# Altium project CM4-Tower.PrjPcb (part 1 of 4)
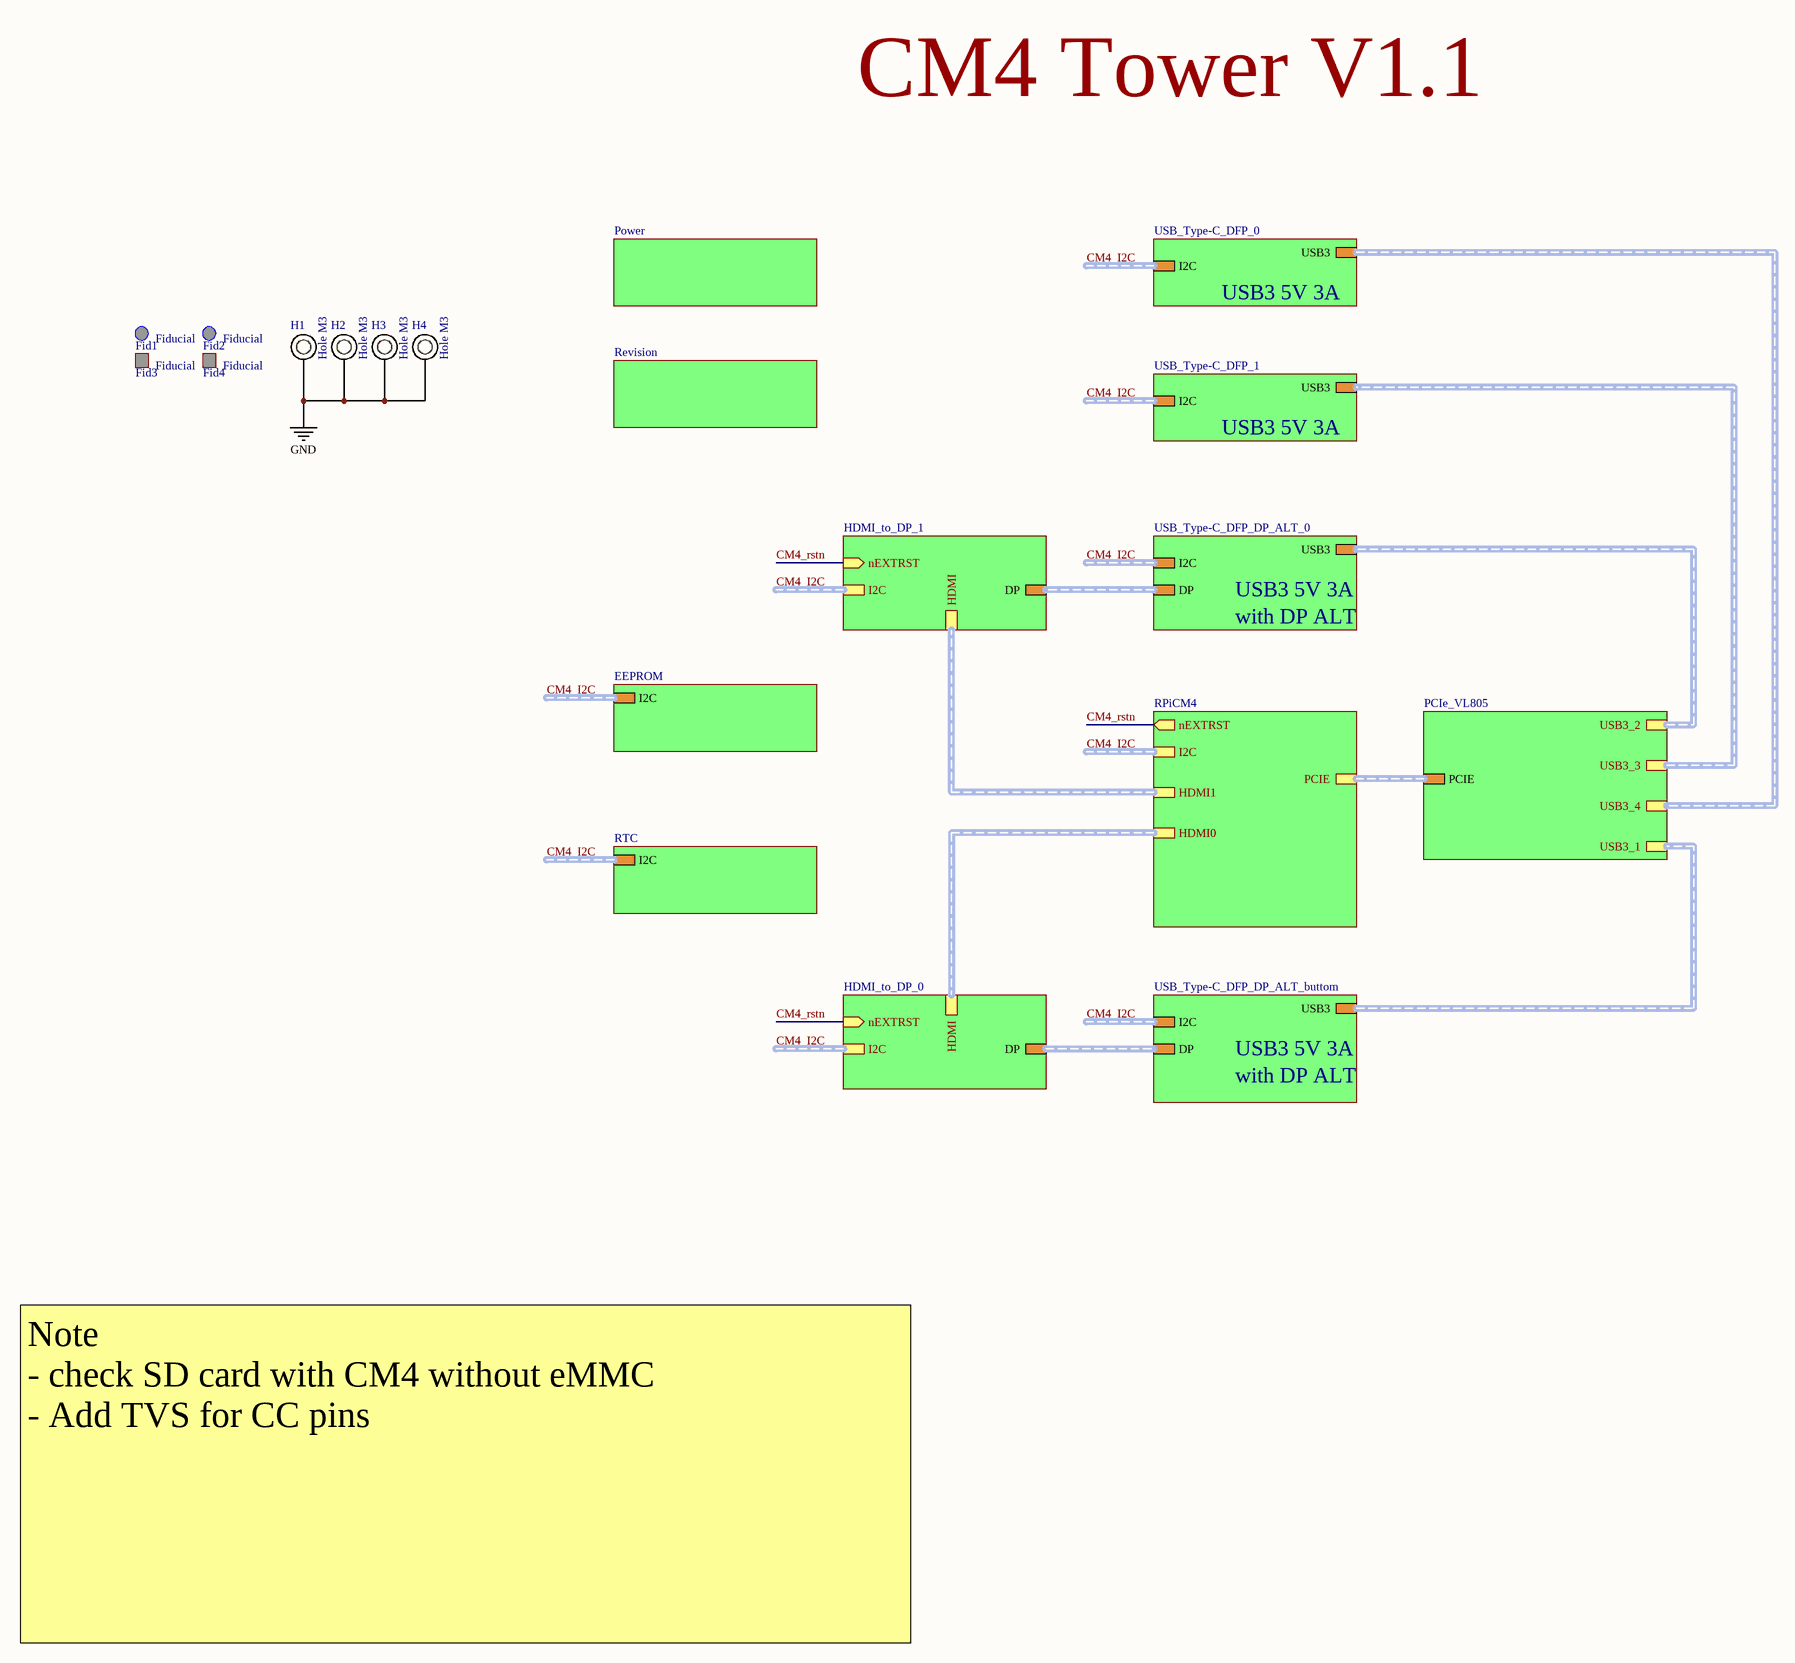
[diagram p0: 01_Top.SchDoc]
=Creator: Mahdi Changani; Rev: 1.1
11 sheets, 636 parts. Net scope: hierarchical (ports join the sheet entries above them; power ports are global).
Board file: CM4-Tower.PcbDoc
Sheets:
  01_Top.SchDoc
    USB_Type-C_DFP_DP_ALT_buttom = 08_USB_Type-C_DFP_DP_ALT_buttom.SchDoc
    Power = 02_Power.SchDoc
    RPiCM4 = 03_RPiCM4.SchDoc
    USB_Type-C_DFP_0 = 06_USB_Type-C_DFP.SchDoc
    USB_Type-C_DFP_1 = 06_USB_Type-C_DFP.SchDoc
    PCIe_VL805 = 04_PCIe_VL805.SchDoc
    HDMI_to_DP_0 = 05_HDMI_to_DP.SchDoc
    USB_Type-C_DFP_DP_ALT_0 = 07_USB_Type-C_DFP_DP_ALT.SchDoc
    HDMI_to_DP_1 = 05_HDMI_to_DP.SchDoc
    EEPROM = 10_EEPROM.SchDoc
    RTC = 09_RTC.SchDoc
    Revision = 11_Revision.SchDoc

## Sheet 01_Top.SchDoc: CM4 Tower part 2 Overview
size A2; Organization: Greenfield Tech Solutions; Address1: Molendreef 33; Address2: Ossendrecht; Address3: 4641CS; Address4: The Netherlands; Revision: 1.1; SheetNumber: 1; SheetTotal: 11

### Parts
Fid1  Fiducial  [FidR_1.0mm]  (no BOM)
Fid2  Fiducial  [FidR_1.0mm]  (no BOM)
Fid3  Fiducial  [FidS_1.0mm]  (no BOM)
Fid4  Fiducial  [FidS_1.0mm]  (no BOM)
H1  Hole M3  [HOLE_M3]  (no BOM)
H2  Hole M3  [HOLE_M3]  (no BOM)
H3  Hole M3  [HOLE_M3]  (no BOM)
H4  Hole M3  [HOLE_M3]  (no BOM)

### Sub-sheets
EEPROM = 10_EEPROM.SchDoc: I2C (harness I2C)
HDMI_to_DP_0 = 05_HDMI_to_DP.SchDoc: DP (harness DP), HDMI (harness HDMI), nEXTRST (in), I2C (harness I2C)
HDMI_to_DP_1 = 05_HDMI_to_DP.SchDoc: DP (harness DP), HDMI (harness HDMI), nEXTRST (in), I2C (harness I2C)
PCIe_VL805 = 04_PCIe_VL805.SchDoc: PCIE (harness PCIE), USB3_1 (harness USB3), USB3_2 (harness USB3), USB3_3 (harness USB3), USB3_4 (harness USB3)
Power = 02_Power.SchDoc: no entries
Revision = 11_Revision.SchDoc: no entries
RPiCM4 = 03_RPiCM4.SchDoc: I2C (harness I2C), PCIE (harness PCIE), HDMI0 (harness HDMI), HDMI1 (harness HDMI), nEXTRST (out)
RTC = 09_RTC.SchDoc: I2C (harness I2C)
USB_Type-C_DFP_0 = 06_USB_Type-C_DFP.SchDoc: USB3 (harness USB3), I2C (harness I2C)
USB_Type-C_DFP_1 = 06_USB_Type-C_DFP.SchDoc: USB3 (harness USB3), I2C (harness I2C)
USB_Type-C_DFP_DP_ALT_0 = 07_USB_Type-C_DFP_DP_ALT.SchDoc: USB3 (harness USB3), I2C (harness I2C), DP (harness DP)
USB_Type-C_DFP_DP_ALT_buttom = 08_USB_Type-C_DFP_DP_ALT_buttom.SchDoc: USB3 (harness USB3), I2C (harness I2C), DP (harness DP)

### Nets
GND: H1.1 H2.1 H3.1 H4.1
CM4_rstn: sheet RPiCM4/nEXTRST, sheet HDMI_to_DP_0/nEXTRST, sheet HDMI_to_DP_1/nEXTRST

### Buses and harness runs
harness CM4_I2C = sheet EEPROM/I2C
harness CM4_I2C = sheet HDMI_to_DP_0/I2C
harness CM4_I2C = sheet HDMI_to_DP_1/I2C
harness CM4_I2C = sheet RPiCM4/I2C
harness CM4_I2C = sheet RTC/I2C
harness CM4_I2C = sheet USB_Type-C_DFP_0/I2C
harness CM4_I2C = sheet USB_Type-C_DFP_1/I2C
harness CM4_I2C = sheet USB_Type-C_DFP_DP_ALT_0/I2C
harness CM4_I2C = sheet USB_Type-C_DFP_DP_ALT_buttom/I2C
harness sheet HDMI_to_DP_0/DP = sheet USB_Type-C_DFP_DP_ALT_buttom/DP
harness sheet HDMI_to_DP_0/HDMI = sheet RPiCM4/HDMI0
harness sheet HDMI_to_DP_1/DP = sheet USB_Type-C_DFP_DP_ALT_0/DP
harness sheet HDMI_to_DP_1/HDMI = sheet RPiCM4/HDMI1
harness sheet PCIe_VL805/PCIE = sheet RPiCM4/PCIE
harness sheet PCIe_VL805/USB3_1 = sheet USB_Type-C_DFP_DP_ALT_buttom/USB3
harness sheet PCIe_VL805/USB3_2 = sheet USB_Type-C_DFP_DP_ALT_0/USB3
harness sheet PCIe_VL805/USB3_3 = sheet USB_Type-C_DFP_1/USB3
harness sheet PCIe_VL805/USB3_4 = sheet USB_Type-C_DFP_0/USB3

### Notes on the sheet
- CM4 Tower V1.1
- USB3 5V 3A
- with DP ALT
- Note
  - check SD card with CM4 without eMMC
  - Add TVS for CC pins
- Title
- Size:
- Date:
- File:
- A2
- Number:
- Time:
- Revision:
- Sheet
- of

### Library data of the parts
Fid1 Fid2 = ME0011: Fiducial Round 1mm; Part Number: ME0011; ID: 11; RefVal: Fiducial
Fid3 Fid4 = ME0012: Fiducial Sqaure 1mm; Part Number: ME0012; ID: 12; RefVal: Fiducial
H1-H4 = ME0001: Mounting Hole M3; Part Number: ME0001; ID: 1; RefVal: Hole M3

## Sheet 08_USB_Type-C_DFP_DP_ALT_buttom.SchDoc: USB-C Connectors
size A2; Organization: Greenfield Tech Solutions; Address1: Molendreef 33; Address2: Ossendrecht; Address3: 4641CS; Address4: The Netherlands; Revision: 1.1; SheetNumber: 8; SheetTotal: 11
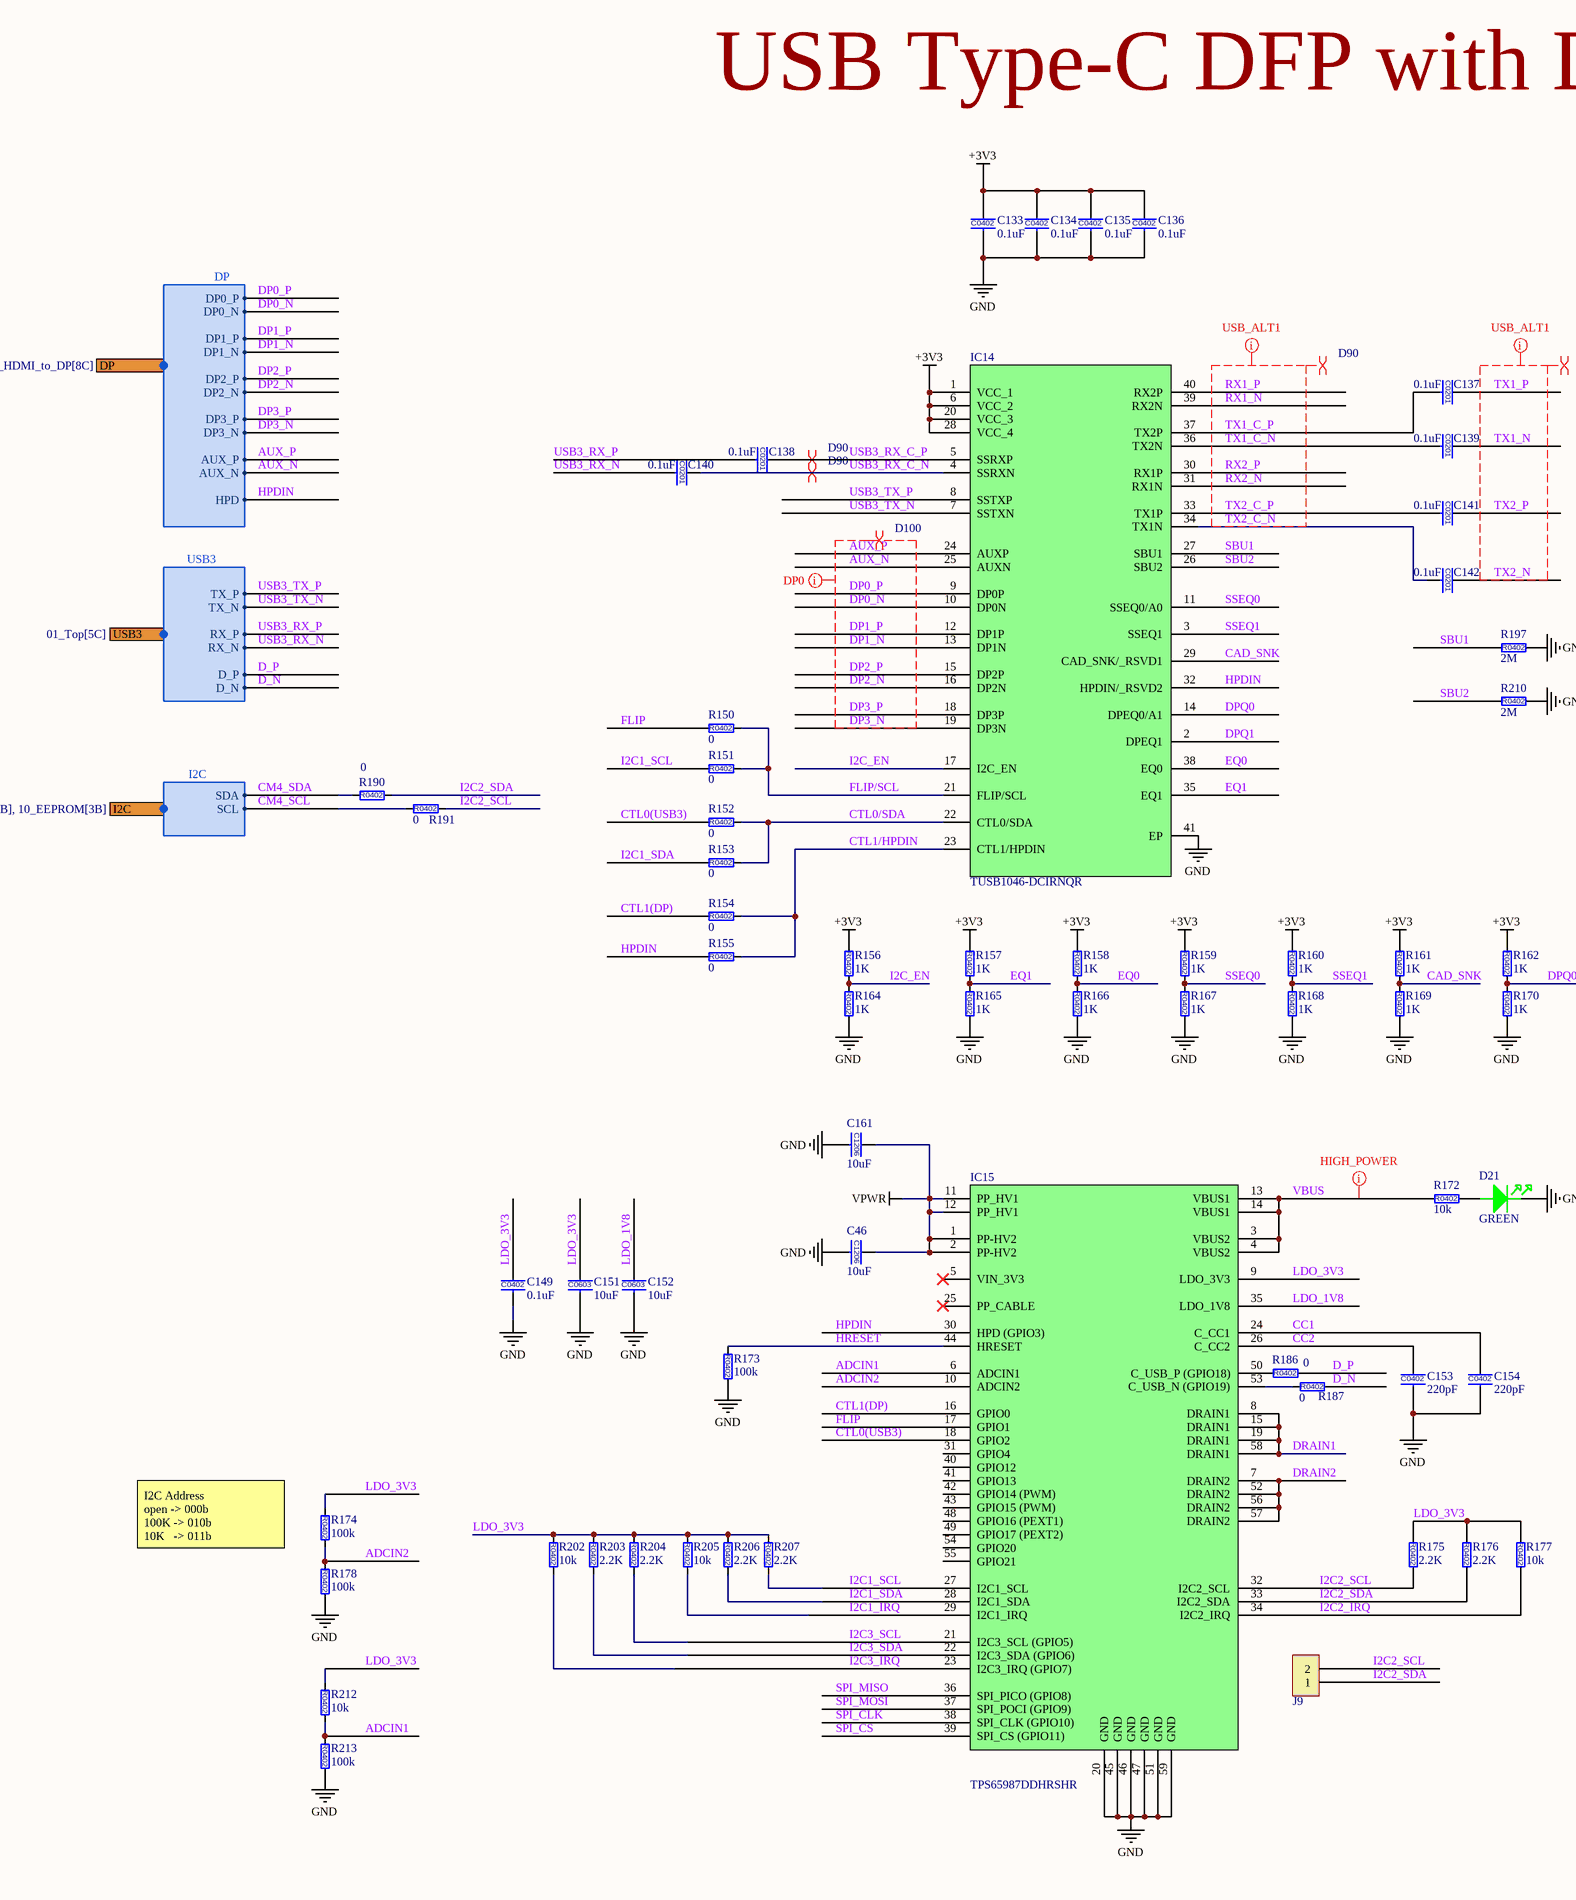
[diagram p1: 08_USB_Type-C_DFP_DP_ALT_buttom.SchDoc, left]
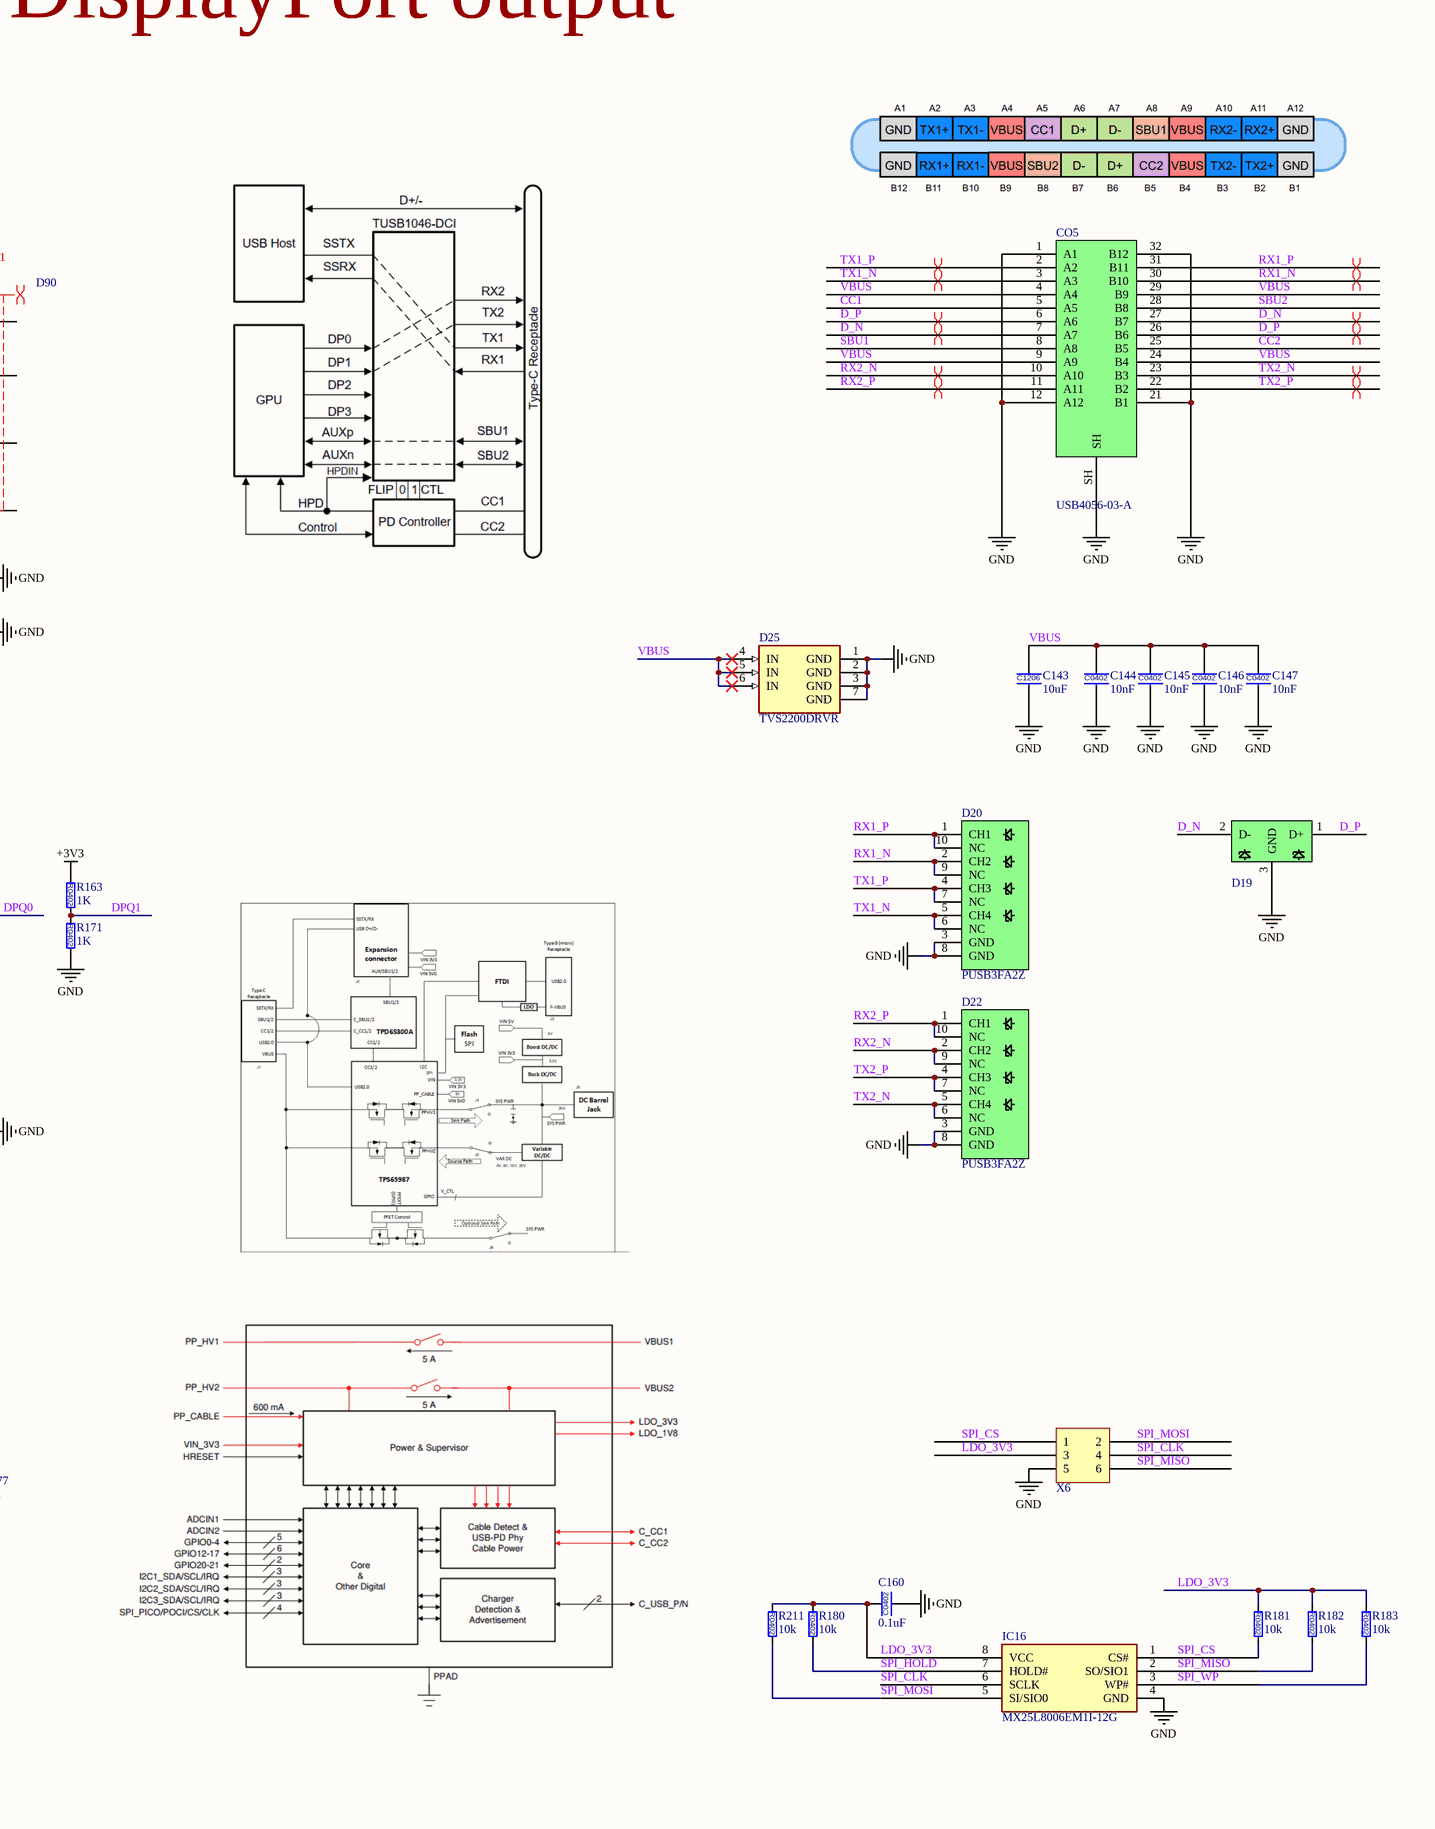
[diagram p2: 08_USB_Type-C_DFP_DP_ALT_buttom.SchDoc, right]

### Parts
C46  10uF  [C1206]
C133  0.1uF  [C0402]
C134  0.1uF  [C0402]
C135  0.1uF  [C0402]
C136  0.1uF  [C0402]
C137  0.1uF  [C0201]
C138  0.1uF  [C0201]
C139  0.1uF  [C0201]
C140  0.1uF  [C0201]
C141  0.1uF  [C0201]
C142  0.1uF  [C0201]
C143  10uF  [C1206]
C144  10nF  [C0402]
C145  10nF  [C0402]
C146  10nF  [C0402]
C147  10nF  [C0402]
C149  0.1uF  [C0402]
C151  10uF  [C0603]
C152  10uF  [C0603]
C153  220pF  [C0402]
C154  220pF  [C0402]
C160  0.1uF  [C0402]
C161  10uF  [C1206]
CO5  USB4056-03-A  [USB4056-03-A]
D19  TPD2EUSB30DRTR  [TPD2EUSB30DRTR_SOT-3]  (value not drawn)
D20  PUSB3FA2Z  [PUSB3FA2Z_DFN_2510_10]
D21  GREEN  [LED_0603]
D22  PUSB3FA2Z  [PUSB3FA2Z_DFN_2510_10]
D25  TVS2200DRVR  [TVS2200D_SON_6]
IC14  TUSB1046-DCIRNQR  [TUSB1046_WQFN_40]
IC15  TPS65987DDHRSHR  [TPS65987D_VQFN-56]
IC16  MX25L8006EM1I-12G  [SOIC127P600X175-8N]
J9  PLS-2  [PLS-2-3D]  (value not drawn)
R150  0  [R0402]
R151  0  [R0402]
R152  0  [R0402]
R153  0  [R0402]
R154  0  [R0402]
R155  0  [R0402]
R156  1K  [R0402]
R157  1K  [R0402]
R158  1K  [R0402]
R159  1K  [R0402]
R160  1K  [R0402]
R161  1K  [R0402]
R162  1K  [R0402]
R163  1K  [R0402]
R164  1K  [R0402]
R165  1K  [R0402]
R166  1K  [R0402]
R167  1K  [R0402]
R168  1K  [R0402]
R169  1K  [R0402]
R170  1K  [R0402]
R171  1K  [R0402]
R172  10k  [R0402]
R173  100k  [R0402]
R174  100k  [R0402]
R175  2.2K  [R0402]
R176  2.2K  [R0402]
R177  10k  [R0402]
R178  100k  [R0402]
R180  10k  [R0402]
R181  10k  [R0402]
R182  10k  [R0402]
R183  10k  [R0402]
R186  0  [R0402]
R187  0  [R0402]
R190  0  [R0402]
R191  0  [R0402]
R197  2M  [R0402]
R202  10k  [R0402]
R203  2.2K  [R0402]
R204  2.2K  [R0402]
R205  10k  [R0402]
R206  2.2K  [R0402]
R207  2.2K  [R0402]
R210  2M  [R0402]
R211  10k  [R0402]
R212  10k  [R0402]
R213  100k  [R0402]
X6  PBD-6  [PXD-6]  (value not drawn)

### Ports
DP (harness DP, see 01_Top[4C], 05_HDMI_to_DP[8C]), I2C (harness I2C, see 01_Top[4C], 03_RPiCM4[1B], 05_HDMI_to_DP[1B], 06_USB_Type-C_DFP[1B], 07_USB_Type-C_DFP_DP_ALT[1B], 09_RTC[3B], 10_EEPROM[3B]), USB3 (harness USB3, see 01_Top[5C])

### Harnesses
USB3: TX_P, TX_N, RX_P, RX_N, D_P, D_N
I2C: SDA, SCL
DP: DP0_P, DP1_P, DP1_N, DP0_N, DP3_P, DP3_N, DP2_P, DP2_N, AUX_P, AUX_N, HPD

### Nets
+3V3: C133.1 C134.1 C135.1 C136.1 IC14.1(VCC_1) IC14.6(VCC_2) IC14.20(VCC_3) IC14.28(VCC_4) R156.1 R157.1 R158.1 R159.1 R160.1 R161.1 R162.1 R163.1
GND: C46.2 C133.2 C134.2 C135.2 C136.2 C143.2 C144.2 C145.2 C146.2 C147.2 C149.2 C151.2 C152.2 C153.2 C154.2 C160.2 C161.2 CO5.1(A1) CO5.12(A12) CO5.21(B1) CO5.32(B12) CO5.SH D19.3(GND) D20.3(GND) D20.8(GND) D21.1(Cathode) D22.3(GND) D22.8(GND) D25.1(GND) D25.2(GND) D25.3(GND) D25.7(GND) IC14.41(EP) IC15.20(GND) IC15.45(GND) IC15.46(GND) IC15.47(GND) IC15.51(GND) IC15.59(GND) IC16.4(GND) R164.2 R165.2 R166.2 R167.2 R168.2 R169.2 R170.2 R171.2 R173.2 R178.2 R197.2 R210.2 R213.2 X6.5
VPWR: C46.1 C161.1 IC15.1(PP-HV2) IC15.2(PP-HV2) IC15.11(PP_HV1) IC15.12(PP_HV1)
ADCIN1: IC15.6(ADCIN1) R212.2 R213.1
ADCIN2: IC15.10(ADCIN2) R174.2 R178.1
AUX_N: IC14.25(AUXN) ; port DP.AUX_N
AUX_P: IC14.24(AUXP) ; port DP.AUX_P
CAD_SNK: IC14.29(CAD_SNK/_RSVD1) R161.2 R169.1
CC1: C154.1 CO5.5(A5) IC15.24(C_CC1)
CC2: C153.1 CO5.25(B5) IC15.26(C_CC2)
CM4_SCL: R191.1 ; port I2C.SCL  [project net CM4_I2C.SCL]
CM4_SDA: R190.1 ; port I2C.SDA  [project net CM4_I2C.SDA]
CTL0(USB3): IC15.18(GPIO2) R152.1
CTL0/SDA: IC14.22(CTL0/SDA) R152.2 R153.2
CTL1(DP): IC15.16(GPIO0) R154.1
CTL1/HPDIN: IC14.23(CTL1/HPDIN) R154.2 R155.2
D_N: CO5.7(A7) CO5.27(B7) D19.2(D-) R187.2 ; port USB3.D_N
D_P: CO5.6(A6) CO5.26(B6) D19.1(D+) R186.2 ; port USB3.D_P
DP0_N: IC14.10(DP0N) ; port DP.DP0_N
DP0_P: IC14.9(DP0P) ; port DP.DP0_P
DP1_N: IC14.13(DP1N) ; port DP.DP1_N
DP1_P: IC14.12(DP1P) ; port DP.DP1_P
DP2_N: IC14.16(DP2N) ; port DP.DP2_N
DP2_P: IC14.15(DP2P) ; port DP.DP2_P
DP3_N: IC14.19(DP3N) ; port DP.DP3_N
DP3_P: IC14.18(DP3P) ; port DP.DP3_P
DPQ0: IC14.14(DPEQ0/A1) R162.2 R170.1
DPQ1: IC14.2(DPEQ1) R163.2 R171.1
DRAIN1: IC15.8(DRAIN1) IC15.15(DRAIN1) IC15.19(DRAIN1) IC15.58(DRAIN1)
DRAIN2: IC15.7(DRAIN2) IC15.52(DRAIN2) IC15.56(DRAIN2) IC15.57(DRAIN2)
EQ0: IC14.38(EQ0) R158.2 R166.1
EQ1: IC14.35(EQ1) R157.2 R165.1
FLIP: IC15.17(GPIO1) R150.1
FLIP/SCL: IC14.21(FLIP/SCL) R150.2 R151.2
HPDIN: IC14.32(HPDIN/_RSVD2) IC15.30(HPD_(GPIO3)) R155.1 ; port DP.HPD  [project net DP_HPD]
HRESET: IC15.44(HRESET) R173.1
I2C1_IRQ: IC15.29(I2C1_IRQ) R205.2
I2C1_SCL: IC15.27(I2C1_SCL) R151.1 R207.2
I2C1_SDA: IC15.28(I2C1_SDA) R153.1 R206.2
I2C2_IRQ: IC15.34(I2C2_IRQ) R177.2
I2C2_SCL: IC15.32(I2C2_SCL) J9.2 R175.2 R191.2
I2C2_SDA: IC15.33(I2C2_SDA) J9.1 R176.2 R190.2
I2C3_IRQ: IC15.23(I2C3_IRQ_(GPIO7)) R202.2
I2C3_SCL: IC15.21(I2C3_SCL_(GPIO5)) R204.2
I2C3_SDA: IC15.22(I2C3_SDA_(GPIO6)) R203.2
I2C_EN: IC14.17(I2C_EN) R156.2 R164.1
LDO_1V8: C152.1 IC15.35(LDO_1V8)
LDO_3V3: C149.1 C151.1 C160.1 IC15.9(LDO_3V3) IC16.8(VCC) R174.1 R175.1 R176.1 R177.1 R180.1 R181.1 R182.1 R183.1 R202.1 R203.1 R204.1 R205.1 R206.1 R207.1 R211.1 R212.1 X6.3
RX1_N: CO5.30(B10) D20.2(CH2) D20.9(NC) IC14.39(RX2N)
RX1_P: CO5.31(B11) D20.1(CH1) D20.10(NC) IC14.40(RX2P)
RX2_N: CO5.10(A10) D22.2(CH2) D22.9(NC) IC14.31(RX1N)
RX2_P: CO5.11(A11) D22.1(CH1) D22.10(NC) IC14.30(RX1P)
SBU1: CO5.8(A8) IC14.27(SBU1) R197.1
SBU2: CO5.28(B8) IC14.26(SBU2) R210.1
SPI_CLK: IC15.38(SPI_CLK_(GPIO10)) IC16.6(SCLK) X6.4
SPI_CS: IC15.39(SPI_CS_(GPIO11)) IC16.1(CS#) R181.2 X6.1
SPI_HOLD: IC16.7(HOLD#) R180.2
SPI_MISO: IC15.36(SPI_PICO_(GPIO8)) IC16.2(SO/SIO1) R182.2 X6.6
SPI_MOSI: IC15.37(SPI_POCI_(GPIO9)) IC16.5(SI/SIO0) R211.2 X6.2
SPI_WP: IC16.3(WP#) R183.2
SSEQ0: IC14.11(SSEQ0/A0) R159.2 R167.1
SSEQ1: IC14.3(SSEQ1) R160.2 R168.1
TX1_C_N: C139.2 IC14.36(TX2N)
TX1_C_P: C137.2 IC14.37(TX2P)
TX1_N: C139.1 CO5.3(A3) D20.5(CH4) D20.6(NC)
TX1_P: C137.1 CO5.2(A2) D20.4(CH3) D20.7(NC)
TX2_C_N: C142.2 IC14.34(TX1N)
TX2_C_P: C141.2 IC14.33(TX1P)
TX2_N: C142.1 CO5.23(B3) D22.5(CH4) D22.6(NC)
TX2_P: C141.1 CO5.22(B2) D22.4(CH3) D22.7(NC)
USB3_RX_C_N: C140.1 IC14.4(SSRXN)
USB3_RX_C_P: C138.1 IC14.5(SSRXP)
USB3_RX_N: C140.2 ; port USB3.RX_N  [project net USB1_RX_N]
USB3_RX_P: C138.2 ; port USB3.RX_P  [project net USB1_RX_P]
USB3_TX_N: IC14.7(SSTXN) ; port USB3.TX_N  [project net USB1_TX_N]
USB3_TX_P: IC14.8(SSTXP) ; port USB3.TX_P  [project net USB1_TX_P]
VBUS: C143.1 C144.1 C145.1 C146.1 C147.1 CO5.4(A4) CO5.9(A9) CO5.24(B4) CO5.29(B9) D25.4(IN) D25.5(IN) D25.6(IN) IC15.3(VBUS2) IC15.4(VBUS2) IC15.13(VBUS1) IC15.14(VBUS1) R172.1
NetD21_2: D21.2(Anode) R172.2
NetIC15_50: IC15.50(C_USB_P_(GPIO18)) R186.1
NetIC15_53: IC15.53(C_USB_N_(GPIO19)) R187.1

Not connected (* = marked no-connect by the designer): IC15 5(VIN_3V3)* 25(PP_CABLE)* 31(GPIO4) 40(GPIO12) 41(GPIO13) 42(GPIO14_(PWM)) 43(GPIO15_(PWM)) 48(GPIO16_(PEXT1)) 49(GPIO17_(PEXT2)) 54(GPIO20) 55(GPIO21)

### Layout directives
differential pair; differential pair class USB3: D_N, D_P, RX1_N, RX1_P, RX2_N, RX2_P, TX1_N, TX1_P, TX2_N, TX2_P
differential pair; differential pair class D90: RX1_N, RX1_P, RX2_N, RX2_P, TX1_C_N, TX1_C_P, TX1_N, TX1_P, TX2_C_N, TX2_C_P, TX2_N, TX2_P, USB3_RX_C_N, USB3_RX_C_P
net class USB_ALT1: RX1_N, RX1_P, RX2_N, RX2_P, TX1_C_N, TX1_C_P, TX1_N, TX1_P, TX2_C_N, TX2_C_P, TX2_N, TX2_P
net class HIGH_POWER: VBUS
differential pair; differential pair class D100: AUX_N, AUX_P, DP0_N, DP0_P, DP1_N, DP1_P, DP2_N, DP2_P, DP3_N, DP3_P
net class DP0: AUX_N, AUX_P, DP0_N, DP0_P, DP1_N, DP1_P, DP2_N, DP2_P, DP3_N, DP3_P

### Notes on the sheet
- USB Type-C DFP with DisplayPort output
- I2C Address
  open -> 000b
  100K -> 010b
  10K   -> 011b
- Title
- Size:
- Date:
- File:
- A2
- Number:
- Time:
- Revision:
- Sheet
- of
- (in symbol 0603ZD106KAT2A) C0603
- (in symbol 02016D104KAT) C0201
- (in symbol 04023A221JAT4A) C0402
- (in symbol 04023D104KAT2A) C0402
- (in symbol 04025C103JAT2A) C0402
- (in symbol 12065D106KAT4A) C1206
- (in symbol CRCW04021K00FKEDC) R0402
- (in symbol CRCW04022K20FK) R0402
- (in symbol CRCW04022M00FKEDC) R0402
- (in symbol CRCW040210K0FK) R0402
- (in symbol CRCW0402100KFKEDC) R0402
- (in symbol CRCW04020000Z0) R0402

### Library data of the parts
C46 C143 C161 = 12065D106KAT4A: CAP CER  10uF 10% 50V X5R 1206; Manufacturer: KYOCERA AVX; Value: 10µF; check: ok; Manufacturer Part Number: 12065D106KAT4A; Tolerance: ±10%; Voltage - Rated: 50V; Temperature Coefficient: X5R
C133-C136 C149 C160 = 04023D104KAT2A: CAP CER  0.1uF 10% 25V X5R 0402; Manufacturer: AVX Corporation; Manufacturer Part Number: 04023D104KAT2A; Value: 0.1uF; Voltage - Rated: 25V; Tolerance: ±10%; Temperature Coefficient: X5R
C137-C142 = 02016D104KAT: CAP CER  0.1uF 10% 6.3V X5R 0201; Manufacturer: AVX Corporation; Capacitance: 100nF; Category: Capacitors; Manufacturer Part Number: 02016D104KAT; Operating Temperature: -55°C ~ 85°C; Package / Case: 0201; Value: 0.1uF; Voltage - Rated: 6.3V; Supplier: Digi-Key; Tolerance: ±10%; Temperature Coefficient: X5R; Mounting Type: Surface Mount, MLCC
C144-C147 = 04025C103JAT2A: CAP CER 10nF 5% 50V X7R 0402; Manufacturer: KYOCERA AVX; Manufacturer Part Number: 04025C103JAT2A; Operating Temperature: -55°C ~ 125°C; Package / Case: 0402 (1005 Metric); Value: 10nF; Voltage - Rated: 50V; Tolerance: ±5%; Temperature Coefficient: X7R
C151 C152 = 0603ZD106KAT2A: CAP CER 10uF 10% 10V X5R 0603; Manufacturer: KYOCERA AVX; Value: 10µF; Manufacturer Part Number: 0603ZD106KAT2A; Tolerance: ±10%; Voltage - Rated: 10V; Temperature Coefficient: X5R
C153 C154 = 04023A221JAT4A: CAP CER  220pF 5% 25V NP0 0402; Manufacturer: KYOCERA AVX; Manufacturer Part Number: 04023A221JAT4A; Operating Temperature: -55°C ~ 125°C; Package / Case: 0402; Value: 220pF; Voltage - Rated: 25V; Tolerance: ±5%; Temperature Coefficient: NP0
CO5 = USB4056-03-A: 24 Position Hybrid Top Mount USB Type C 3.2 Gen Receptacle; Part Number: CO0030; Manufacturer: Global Connector Technology; ID: 29; ManfactPart: USB4056-03-A; RefVal: USB4056; Supplier 1: Farnell; Manufacturer Part Number: USB4056-03-A; RoHS: No; Category: Connectors; Stock 1: 1000; Pricing 1: 1000=0.49400, 5000=0.47700, 10000=0.45400, 20000=0.44500 (EUR); Supplier Part Number 1: 3777667
D19 = TPD2EUSB30DRTR: Dual 0.7-pF, 5.5-V ±8-kV ESD protection diode with 5-A surge rating for USB 3.0 3-SOT-9X3 -40 to 85; Manufacturer: Texas Instruments; Direction: Bidirectional,Unidirectional; Capacitance: 0.8pF; Number of Bidirectional Channels: 2; Reverse Standoff Voltage: 5.5V; Min Breakdown Voltage: 9V; Clamping Voltage: 8V; Peak Pulse Power: 45W; Power Line Protection: Yes; Test Current: 1mA; Peak Pulse Current: 1A; Supplier 1: Mouser; Manufacturer Part Number: TPD2EUSB30DRTR; RoHS: Yes; Category: Integrated Circuits (ICs); Pricing 1: 1=0.66000, 10=0.56100, 50=0.56000, 100=0.41900, 1000=0.25500, 10000=0.23100 (USD); Case/Package: SOT; Number of Pins: 3; Min Operating Temperature: -40°C; Max Operating Temperature: 85°C; Packaging: Tape and Reel; Package Quantity: 1; Breakdown Voltage: 9V; Number of Channels: 2; Working Voltage: 5.5V; ESD Protection: Yes; Element Configuration: Dual; Interface: USB; Series: -; Number of Unidirectional Channels: 2; Length: 1mm; Width: 0.85mm; Height: 0.45mm; Depth: 0.8mm; Radiation Hardening: No; Reach SVHC Compliant: Yes; Lead Free: Lead Free; RoHS Compliant: Yes; ComponentLink1URL: https://datasheet.ciiva.com/1611/tpd2eusb30-1611602.pdf?src-supplier=Newark; ComponentLink1Description: https://datasheet.ciiva.com/1611/tpd2eusb30-1611602.pdf?src-supplier=Newark; ComponentLink2URL: https://datasheet.ciiva.com/15134/getdatasheetpartid-202713-15134479.pdf?src-supplier=Verical; ComponentLink2Description: https://datasheet.ciiva.com/15134/getdatasheetpartid-202713-15134479.pdf?src-supplier=Verical; ComponentLink3URL: https://datasheet.ciiva.com/1504/1882087-1504248.pdf?src-supplier=Element14; ComponentLink3Description: https://datasheet.ciiva.com/1504/1882087-1504248.pdf?src-supplier=Element14; ComponentLink4URL: https://datasheet.ciiva.com/353/tpd2eusb30-353273.pdf?src-supplier=Digi-Key; ComponentLink4Description: https://datasheet.ciiva.com/353/tpd2eusb30-353273.pdf?src-supplier=Digi-Key; ComponentLink5URL: https://datasheet.ciiva.com/353/tpd2eusb30-353272.pdf?src-supplier=Digi-Key; ComponentLink5Description: https://datasheet.ciiva.com/353/tpd2eusb30-353272.pdf?src-supplier=Digi-Key; ComponentLink6URL: https://datasheet.ciiva.com/353/tpd2eusb30-353274.pdf?src-supplier=Digi-Key; ComponentLink6Description: https://datasheet.ciiva.com/353/tpd2eusb30-353274.pdf?src-supplier=Digi-Key; Supplier Part Number 1: 595-TPD2EUSB30DRTR
D20 D22 = PUSB3FA2Z: PUSB3FA2/SOT1176/XSON10; Part Number: DI0007; Manufacturer: Nexperia; ID: 7; RefVal: TVS; ManfactPart: PUSB3FA2Z; Supplier 1: Digi-Key; Manufacturer Part Number: PUSB3FA2Z; RoHS: No; Category: TVS Diodes; Stock 1: 8565; Pricing 1: 1=0.39000, 10=0.31700, 100=0.21570, 500=0.16178, 1000=0.12134, 2000=0.11123 (USD); ComponentLink1URL: http://www.farnell.com/datasheets/2621625.pdf?src-supplier=Farnell; ComponentLink1Description: http://www.farnell.com/datasheets/2621625.pdf?src-supplier=Farnell; ComponentLink2URL: https://assets.nexperia.com/documents/data-sheet/PUSB3FA2.pdf?src-supplier=Digi-Key; ComponentLink2Description: https://assets.nexperia.com/documents/data-sheet/PUSB3FA2.pdf?src-supplier=Digi-Key; ComponentLink3URL: http://www.farnell.com/datasheets/2621625.pdf?src-supplier=Newark; ComponentLink3Description: http://www.farnell.com/datasheets/2621625.pdf?src-supplier=Newark; Supplier Part Number 1: 1727-7813-1-ND; Supplier 2: Farnell; Stock 2: 8440; Pricing 2: 5=0.31600, 10=0.25800, 100=0.17600, 500=0.13300, 1000=0.11400, 5000=0.09420 (GBP); Supplier 3: Digi-Key; Stock 3: 5000; Pricing 3: 5000=0.10449, 10000=0.09774, 25000=0.09450 (USD); Supplier Part Number 3: 1727-7813-2-ND; Supplier Part Number 2: 2901054
D21 = LED_SMD_0603_GREEN: LED Uni-Color Yellow Green 574nm 2-Pin Chip 0603(1608Metric) T/R; Manufacturer: Vishay Semiconductors; Manufacturer Part Number: VLMG1300-GS08; Color: Green,Yellow; Forward Voltage: 2V; Forward Current: 20mA; Lens Style: Rectangular,Clear; Luminous Intensity: 35mcd; Number of LEDs: 1; Viewing Angle: 130°; Dominant Wavelength: 571nm; Power Dissipation: 75mW; Reverse Voltage: 5V; Supplier 1: Farnell; RoHS: Yes; Category: LEDs; Stock 1: 18400; Pricing 1: 5=0.31000, 10=0.23700, 100=0.10900, 500=0.09900 (EUR); Mount: Surface Mount; Case/Package: 0603; Number of Pins: 2; Case Code (Metric): 1608; Case Code (Imperial): 0603; Min Operating Temperature: -35°C; Max Operating Temperature: 85°C; Packaging: Tape and Reel; Package Quantity: 1; Series: CHipLED; Illumination Color: Green,Yellow; Wavelength: 571nm; Test Current: 20mA; Number of Elements: 1; Power Rating: 75mW; Length: 1.6mm; Width: 0.8mm; Height: 0.8mm; Depth: 0.8mm; Radiation Hardening: No; RoHS Compliant: Yes; Lead Free: Lead Free; ComponentLink1URL: https://datasheet.ciiva.com/8028/vlmo1300-8028023.pdf?src-supplier=Element14; ComponentLink1Description: https://datasheet.ciiva.com/8028/vlmo1300-8028023.pdf?src-supplier=Element14; ComponentLink2URL: https://datasheet.ciiva.com/2114/vlmo1300-2114971.pdf?src-supplier=Digi-Key; ComponentLink2Description: https://datasheet.ciiva.com/2114/vlmo1300-2114971.pdf?src-supplier=Digi-Key; ComponentLink3URL: https://datasheet.ciiva.com/26322/vlmo1300-26322139.pdf?src-supplier=Element14; ComponentLink3Description: https://datasheet.ciiva.com/26322/vlmo1300-26322139.pdf?src-supplier=Element14; ComponentLink4URL: https://datasheet.ciiva.com/2114/vlmo1300-2114972.pdf?src-supplier=Digi-Key; ComponentLink4Description: https://datasheet.ciiva.com/2114/vlmo1300-2114972.pdf?src-supplier=Digi-Key; ComponentLink5URL: https://datasheet.ciiva.com/26322/vlmo1300-26322140.pdf?src-supplier=Element14; ComponentLink5Description: https://datasheet.ciiva.com/26322/vlmo1300-26322140.pdf?src-supplier=Element14; ComponentLink6URL: https://datasheet.ciiva.com/2114/vlmo1300-2114973.pdf?src-supplier=Digi-Key; ComponentLink6Description: https://datasheet.ciiva.com/2114/vlmo1300-2114973.pdf?src-supplier=Digi-Key; ComponentLink7URL: https://datasheet.ciiva.com/9333/vlmo1300-9333390.pdf?src-supplier=Avnet; ComponentLink7Description: https://datasheet.ciiva.com/9333/vlmo1300-9333390.pdf?src-supplier=Avnet; Supplier Part Number 1: 2251461
D25 = TVS2200DRVR: 22-V flat-clamp surge protection device 6-WSON -40 to 125; Manufacturer: Texas Instruments; Reverse Standoff Voltage: 22V; Standoff Height: 0mm; Clamping Voltage: 27.7V; Number Of Channels: 1; Capacitance: 105pF; Value: 105pF; Direction: Unidirectional; Breakdown Voltage: 24.6V; Peak Pulse Current: 40A; Package: DRV0006A; Category: Diode; Device Class L3: unset; Device Class L1: Circuit Protection; Temperature: -40°C to +125°C; ComponentLink2Description: Datasheet; Height: 0.8mm; Ambient Temperature Range Low: -40°C; Octopart: https://octopart.com/tvs2200drvr-texas+instruments-88217346; Temperature Range High: +125°C; Automotive: No; Temperature Range Low: -40°C; Ipc Land Pattern Name: DFN200X200X75-6; Manufacturer Part Number: TVS2200DRVR; Device Class L2: ESD and Circuit Protection ICs; RoHS: TRUE; Lead Free: Yes; Ambient Temperature Range High: +125°C; Mouser Description: Diode TVS Single Uni-Dir 22V 1.12KW 6-Pin WSON EP T/R; ComponentLink2URL: http://www.ti.com/lit/ds/symlink/tvs2200.pdf; Digikey Description: UNIDIR PRECISION SURGE DIODE; Supplier 1: Mouser; Pricing 1: 1=0.56000, 10=0.47800, 50=0.44600, 100=0.35700, 1000=0.21700, 10000=0.19700 (USD); Mount: Surface Mount; Min Operating Temperature: -40°C; Max Operating Temperature: 125°C; Packaging: Tape and Reel; Number of Circuits: 1; RoHS Compliant: Yes; ComponentLink1URL: http://www.ti.com/lit/ds/symlink/tvs2200.pdf?src-supplier=Digi-Key; ComponentLink1Description: http://www.ti.com/lit/ds/symlink/tvs2200.pdf?src-supplier=Digi-Key; ComponentLink3URL: http://www.ti.com/general/docs/suppproductinfo.tsp?distId=10&amp;gotoUrl=http%3A%2F%2Fwww.ti.com%2Flit%2Fgpn%2Ftvs2200&src-supplier=Digi-Key; ComponentLink3Description: http://www.ti.com/general/docs/suppproductinfo.tsp?distId=10&amp;gotoUrl=http%3A%2F%2Fwww.ti.com%2Flit%2Fgpn%2Ftvs2200&src-supplier=Digi-Key; Supplier Part Number 1: 595-TVS2200DRVR
IC14 = TUSB1046-DCIRNQR: USB Type-C™ DP ALT Mode 10-Gbps linear redriver crosspoint switch for source side 40-WQFN -40 to 85; Manufacturer Part Number: TUSB1046AI-DCIRNQR; Manufacturer: Texas Instruments; Number of Channels: 4; On-State Resistance: 10R; Datasheet Link: https://www.ti.com/lit/ds/symlink/tusb1046-dci.pdf?ts=1635509425736&ref_url=https%253A%252F%252Fwww.google.com%252F; Height: 0.8mm; Mouser Part Number: 595-TUSB1046-DCIRNQR; Mouser Price/Stock: https://www.mouser.co.uk/ProductDetail/Texas-Instruments/TUSB1046-DCIRNQR?qs=Euq2YPj5ArLS2CQihiHSYg%3D%3D; Arrow Part Number: TUSB1046-DCIRNQR; Arrow Price/Stock: https://www.arrow.com/en/products/tusb1046-dcirnqr/texas-instruments; Supplier 1: Mouser; RoHS: Yes; Category: Integrated Circuits (ICs); Pricing 1: 1=9.42000, 10=8.51000, 50=8.12000, 100=7.05000, 1000=5.75000, 10000=5.74000 (USD); Min Operating Temperature: -40°C; Max Operating Temperature: 85°C; RoHS Compliant: Yes; ComponentLink1URL: http://www.ti.com/lit/ds/symlink/tusb1046a-dci.pdf?src-supplier=Digi-Key; ComponentLink1Description: http://www.ti.com/lit/ds/symlink/tusb1046a-dci.pdf?src-supplier=Digi-Key; Supplier Part Number 1: 595-USB1046AIDCIRNQR
IC15 = TPS65987DDHRSHR: USB Type-C™ and USB PD controller with integrated power switches 56-VQFN -10 to 75; Part Number: IC0052; Manufacturer: Texas Instruments; ID: 52; Operating Supply Current: 8mA; ManfactPart: TPS65987DDHRSHR; Supplier 1: Digi-Key; Manufacturer Part Number: TPS65987DDHRSHR; RoHS: Yes; Category: Power Management ICs; Stock 1: 6720; Pricing 1: 1=4.92000, 10=4.41700, 25=4.17600, 100=3.61930, 250=3.43372, 500=3.08106, 1000=2.62650 (USD); Mount: Surface Mount; Case/Package: VQFN; Min Operating Temperature: -10°C; Max Operating Temperature: 75°C; Packaging: Tape and Reel; RoHS Compliant: Yes; ComponentLink1URL: http://www.ti.com/lit/ds/symlink/tps65987d.pdf?src-supplier=Digi-Key; ComponentLink1Description: http://www.ti.com/lit/ds/symlink/tps65987d.pdf?src-supplier=Digi-Key; ComponentLink2URL: http://www.ti.com/general/docs/suppproductinfo.tsp?distId=10&amp;gotoUrl=http%3A%2F%2Fwww.ti.com%2Flit%2Fgpn%2Ftps65987d&src-supplier=Digi-Key; ComponentLink2Description: http://www.ti.com/general/docs/suppproductinfo.tsp?distId=10&amp;gotoUrl=http%3A%2F%2Fwww.ti.com%2Flit%2Fgpn%2Ftps65987d&src-supplier=Digi-Key; RefVal: TPS65987D; Supplier Part Number 1: 296-52067-1-ND
IC16 = MX25L8006EM1I-12G: NOR Flash Serial 3.3V 8M-bit 8M/4M x 1/2-bit 8ns 8-Pin SOP / IC FLASH 8MBIT 86MHZ 8SOP; Manufacturer_Name: Macronix; Operating Supply Voltage: 3.6V; Density: 8Mb; Interface: SPI,Serial; Memory Type: FLASH,NOR; Datasheet Link: https://www.mxic.com.tw/Lists/Datasheet/Attachments/7445/MX25L8006E,%203V,%208Mb,%20v1.6.pdf; Height: 1.75mm; Manufacturer_Part_Number: MX25L8006EM1I-12G; Arrow Part Number: MX25L8006EM1I-12G; Arrow Price/Stock: https://www.arrow.com/en/products/mx25l8006em1i-12g/macronix-international?region=nac; Supplier 1: Digi-Key; Manufacturer: Macronix; Manufacturer Part Number: MX25L8006EM1I-12G; RoHS: Yes; Category: Flash; Stock 1: 66203; Pricing 1: 1=0.58000, 10=0.52500, 25=0.51880, 50=0.51580, 100=0.46120, 250=0.45736, 500=0.45058, 1000=0.43446, 5000=0.39572 (USD); Case/Package: SOIC; Min Operating Temperature: -40°C; Max Operating Temperature: 85°C; Max Frequency: 86MHz; Package Quantity: 98; Packaging: Rail/Tube; Frequency: 86MHz; Series: MX25xxx05/06; Supply Voltage-Nom: 3.6V; Lead Free: Lead Free; Temperature Grade: INDUSTRIAL; RoHS Compliant: Yes; ComponentLink1URL: http://ckassoc.com/oldsite/pdf/Macronix_Product_Line_Card_July_2017_General%20_070617.pdf?src-supplier=Digi-Key; ComponentLink1Description: http://ckassoc.com/oldsite/pdf/Macronix_Product_Line_Card_July_2017_General%20_070617.pdf?src-supplier=Digi-Key; ComponentLink2URL: http://www.macronix.com/QuickPlace/hq/PageLibrary4825740B00298A3B.nsf/h_Index/3F21BAC2E121E17848257639003A3146/$File/MX25L8006E,%203V,%208Mb,%20v1.3.pdf?src-supplier=Future+Electronics; ComponentLink2Description: http://www.macronix.com/QuickPlace/hq/PageLibrary4825740B00298A3B.nsf/h_Index/3F21BAC2E121E17848257639003A3146/$File/MX25L8006E,%203V,%208Mb,%20v1.3.pdf?src-supplier=Future+Electronics; Supplier Part Number 1: 1092-1117-ND
J9 = PLS-2: Pin Header 2.54MM Pitch Str, 1X2PIN, Full G/f, NY6T, 6.1MM*2.5MM*3.0MM / Bag; Manufacturer: Amphenol; Manufacturer Part Number: G800W306018EU; Supplier 1: Mouser; RoHS: Yes; Category: Connectors; Stock 1: 26660; Pricing 1: 1=0.10000, 10=0.04200, 50=0.04200, 100=0.04000, 1000=0.03500, 10000=0.03000 (USD); Supplier Part Number 1: 523-G800W305018EU; Supplier 2: Mouser; Stock 2: 25697; Pricing 2: 1=0.10000, 10=0.03000, 50=0.03000, 100=0.02900, 1000=0.02600, 10000=0.02100 (USD); Supplier Part Number 2: 523-G800W306018EU
R150-R155 R186 R187 R190 R191 = CRCW04020000Z0: RES SMD 0 ohm 1/16W R0402; Manufacturer: Vishay Dale; Manufacturer Part Number: CRCW04020000Z0; Value: 0; Power (Watts): 1/16W; Package / Case: 0402
R156-R171 = CRCW04021K00FKEDC: RES SMD 1K ohm 1% 1/16W R0402; Manufacturer: Vishay; check: ok; Manufacturer Part Number: CRCW04021K00FKEDC; Value: 1K; Power (Watts): 1/16W; Package / Case: 0402; Tolerance: ±1%
R172 R177 R202 R205 R212 = CRCW040210K0FK: RES SMD 10K ohm 1% 1/16W R0402; Manufacturer: Vishay; check: ok; Manufacturer Part Number: CRCW040210K0FK; Value: 10K; Power (Watts): 1/16W; Package / Case: 0402; Tolerance: ±1%
R173 R174 R178 R213 = CRCW0402100KFKEDC: RES SMD 100K ohm 1% 1/16W R0402; Manufacturer: Vishay; check: ok; Manufacturer Part Number: CRCW0402100KFKEDC; Value: 100K; Power (Watts): 1/16W; Package / Case: 0402; Tolerance: ±1%
R175 R176 R203 R204 R206 R207 = CRCW04022K20FK: RES SMD 2.2K ohm 1% 1/16W R0402; Manufacturer: Vishay; check: ok; Manufacturer Part Number: CRCW04022K20FK; Value: 2.2K; Power (Watts): 1/16W; Package / Case: 0402; Tolerance: ±1%
R180-R183 R211 = CRCW040210K0FK: RES SMD 10K ohm 1% 1/16W R0402; Manufacturer: Vishay Dale; Manufacturer Part Number: CRCW040210K0FK; Value: 10K; Power (Watts): 1/16W; Package / Case: 0402; Tolerance: ±1%
R197 R210 = CRCW04022M00FKEDC: RES SMD 2M ohm 1% 1/16W R0402; Manufacturer: Vishay; check: ok; Manufacturer Part Number: CRCW04022M00FKEDC; Value: 2M; Power (Watts): 1/16W; Package / Case: 0402; Tolerance: ±1%
X6 = PBD-6: Conn Unshrouded Header HDR 6 POS 2.54mm Solder ST Thru-Hole Poly Bag; Manufacturer: Amphenol ICC / FCI; Manufacturer Part Number: 10076801-101-06LF; LatestRevisionDate: 17-Jul-2002; LatestRevisionNote: Re-released for DXP Platform.; Publisher: Altium Limited; Supplier 1: Mouser; RoHS: Yes; Category: Headers and Wire Housings; Stock 1: 1821; Pricing 1: 1=0.75000, 10=0.63400, 50=0.63400, 100=0.56500, 1000=0.41000, 10000=0.34100 (USD); ComponentLink1URL: https://datasheet.ciiva.com/9472/10076801-9472106.pdf?src-supplier=Avnet; ComponentLink1Description: https://datasheet.ciiva.com/9472/10076801-9472106.pdf?src-supplier=Avnet; Supplier Part Number 1: 649-1007680110106LF

## Sheet 02_Power.SchDoc: Power
size 558 x 431 mm; Revision: 1.1; SheetNumber: 2; SheetTotal: 11
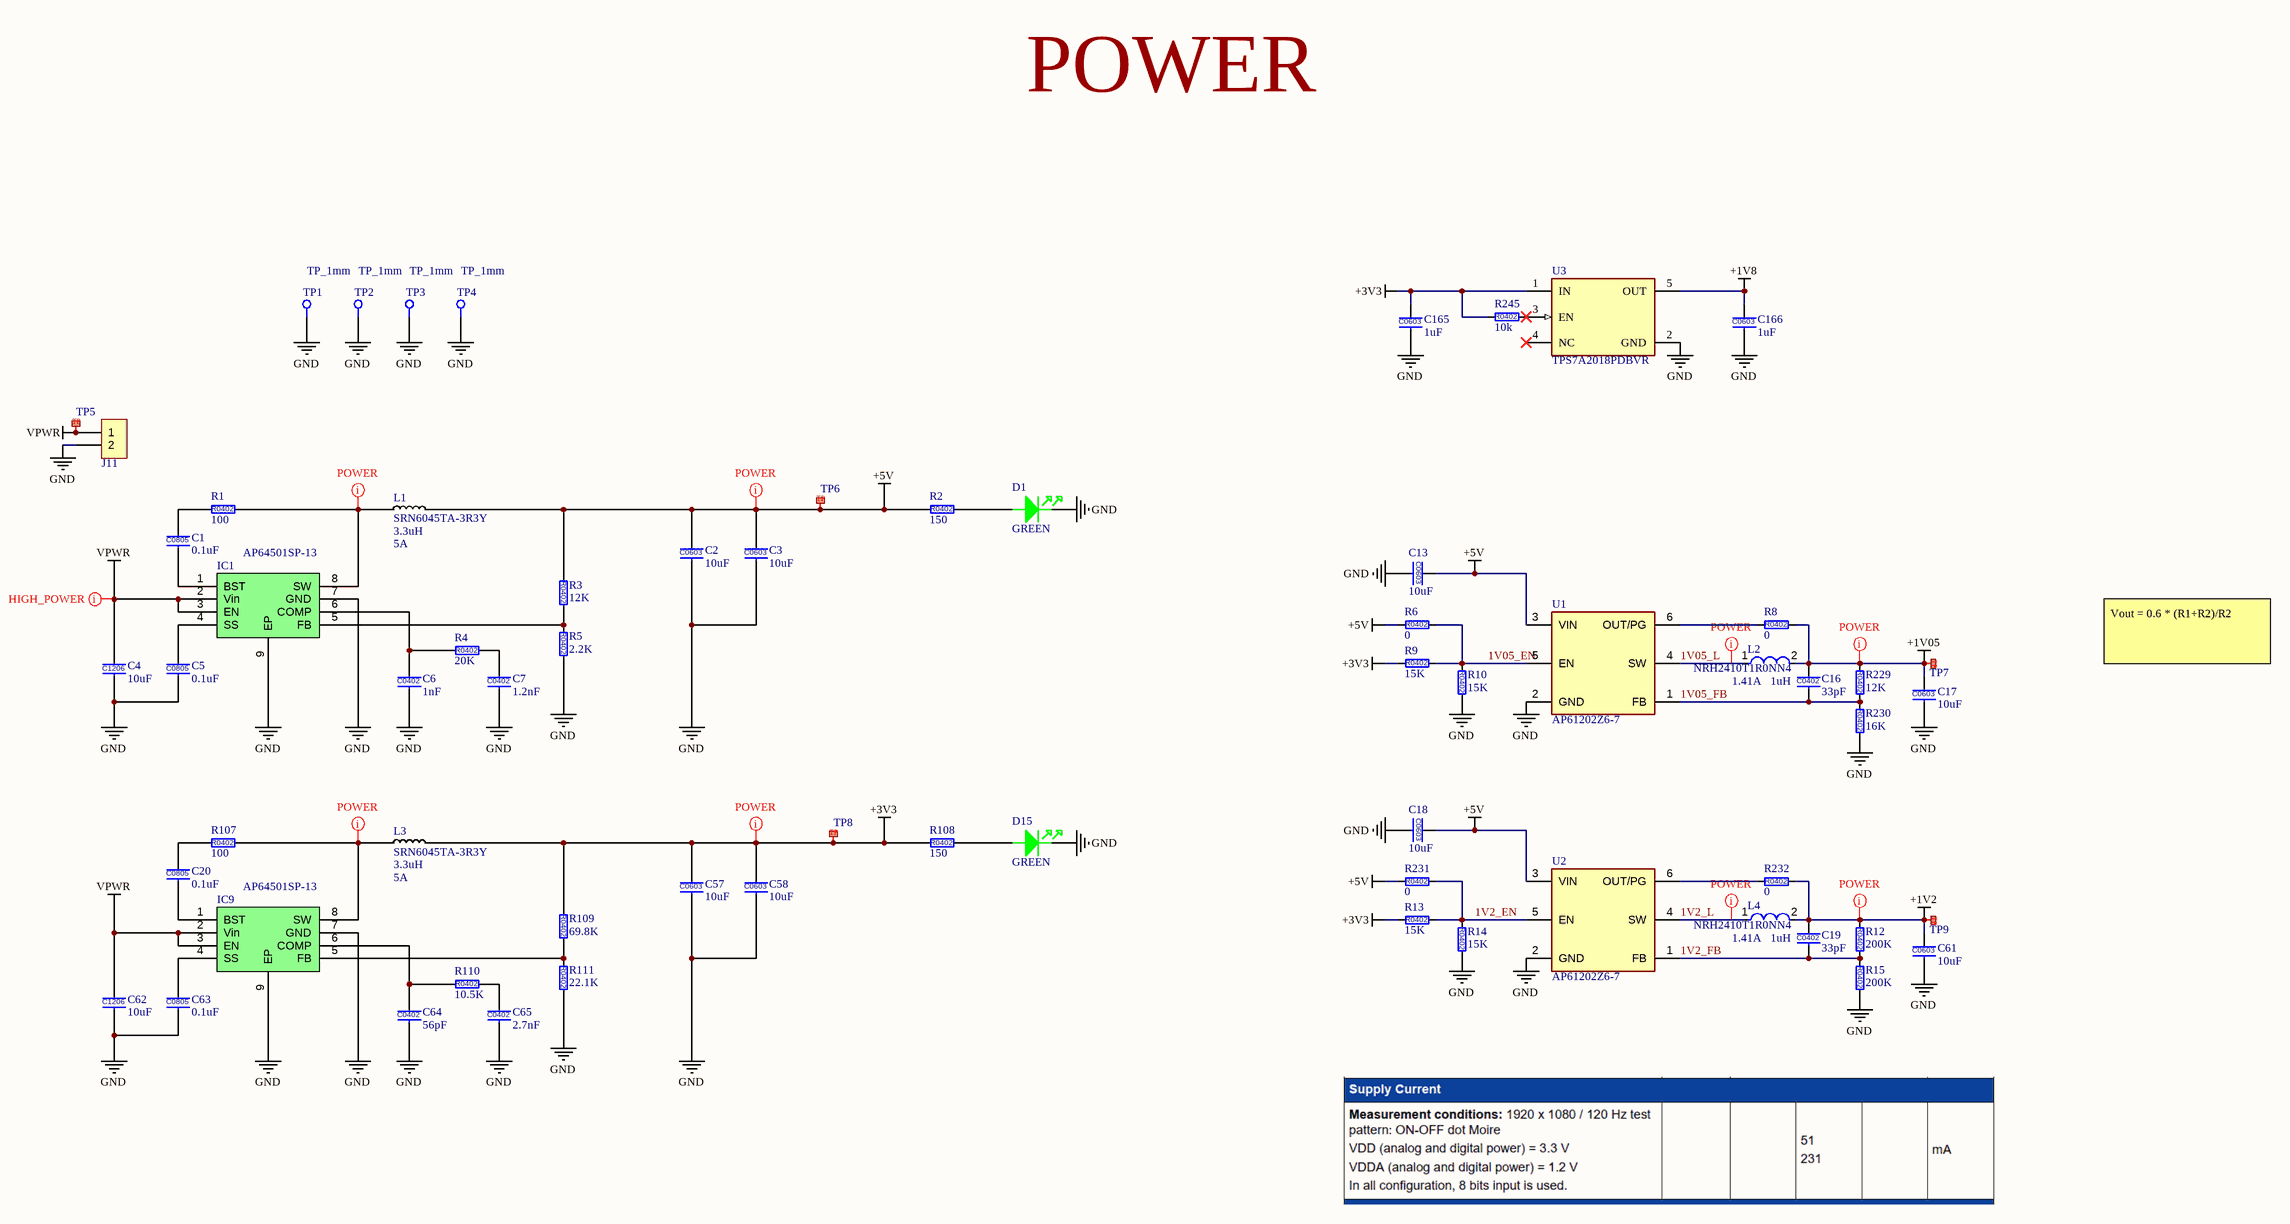
[diagram p3: 02_Power.SchDoc]

### Parts
C1  0.1uF  [C0805]
C2  10uF  [C0603]
C3  10uF  [C0603]
C4  10uF  [C1206]
C5  0.1uF  [C0805]
C6  1nF  [C0402]
C7  1.2nF  [C0402]
C13  10uF  [C0603]
C16  33pF  [C0402]
C17  10uF  [C0603]
C18  10uF  [C0603]
C19  33pF  [C0402]
C20  0.1uF  [C0805]
C57  10uF  [C0603]
C58  10uF  [C0603]
C61  10uF  [C0603]
C62  10uF  [C1206]
C63  0.1uF  [C0805]
C64  56pF  [C0402]
C65  2.7nF  [C0402]
C165  1uF  [C0603]
C166  1uF  [C0603]
D1  GREEN  [LED_0603]
D15  GREEN  [LED_0603]
IC1  AP64501SP-13  [AP64501SP-13_SOIC_8]
IC9  AP64501SP-13  [AP64501SP-13_SOIC_8]
J11  PLS-2  [PLS-2-3D]  (value not drawn)
L1  SRN6045TA-3R3Y  Inductance: 3.3uH  RMS Current (Irms): 5A  [SRN6045TA]
L2  NRH2410T1R0NN4  value 1uH  Current Rating: 1.41A  [NRH2410]
L3  SRN6045TA-3R3Y  Inductance: 3.3uH  RMS Current (Irms): 5A  [SRN6045TA]
L4  NRH2410T1R0NN4  value 1uH  Current Rating: 1.41A  [NRH2410]
R1  100  [R0402]
R2  150  [R0402]
R3  12K  [R0402]
R4  20K  [R0402]
R5  2.2K  [R0402]
R6  0  [R0402]
R8  0  [R0402]
R9  15K  [R0402]
R10  15K  [R0402]
R12  200K  [R0402]
R13  15K  [R0402]
R14  15K  [R0402]
R15  200K  [R0402]
R107  100  [R0402]
R108  150  [R0402]
R109  69.8K  [R0402]
R110  10.5K  [R0402]
R111  22.1K  [R0402]
R229  12K  [R0402]
R230  16K  [R0402]
R231  0  [R0402]
R232  0  [R0402]
R245  10k  [R0402]
TP1  TP_1mm  [TP_1MM]  (no BOM)
TP2  TP_1mm  [TP_1MM]  (no BOM)
TP3  TP_1mm  [TP_1MM]  (no BOM)
TP4  TP_1mm  [TP_1MM]  (no BOM)
TP5  Testpoint 1mm SMD  [TP_1mm_SMD]  (value not drawn)  (no BOM)
TP6  Testpoint 1mm SMD  [TP_1mm_SMD]  (value not drawn)  (no BOM)
TP7  Testpoint 1mm SMD  [TP_1mm_SMD]  (value not drawn)  (no BOM)
TP8  Testpoint 1mm SMD  [TP_1mm_SMD]  (value not drawn)  (no BOM)
TP9  Testpoint 1mm SMD  [TP_1mm_SMD]  (value not drawn)  (no BOM)
U1  AP61202Z6-7  [AP61202Z6-7_SOT563]
U2  AP61202Z6-7  [AP61202Z6-7_SOT563]
U3  TPS7A2018PDBVR  [TPS7A20_SOT_23_5]

### Nets
+1V2: C19.1 C61.1 L4.2 R12.1 R232.2 TP9.1
+1V05: C16.1 C17.1 L2.2 R8.2 R229.1 TP7.1
+1V8: C166.1 U3.5(OUT)
+3V3: C57.1 C58.1 C165.1 L3.2 R9.1 R13.1 R108.1 R109.1 R245.1 TP8.1 U3.1(IN)
+5V: C2.1 C3.1 C13.1 C18.1 L1.2 R2.1 R3.1 R6.1 R231.1 TP6.1 U1.3(VIN) U2.3(VIN)
GND: C2.2 C3.2 C4.2 C5.2 C6.2 C7.2 C13.2 C17.2 C18.2 C57.2 C58.2 C61.2 C62.2 C63.2 C64.2 C65.2 C165.2 C166.2 D1.1(Cathode) D15.1(Cathode) IC1.7(GND) IC1.9(EP) IC9.7(GND) IC9.9(EP) J11.2 R5.2 R10.2 R14.2 R15.2 R111.2 R230.2 TP1.1 TP2.1 TP3.1 TP4.1 U1.2(GND) U2.2(GND) U3.2(GND)
VPWR: C4.1 C62.1 IC1.2(Vin) IC1.3(EN) IC9.2(Vin) IC9.3(EN) J11.1 TP5.1
1V2_EN: R13.2 R14.1 R231.2 U2.5(EN)
1V2_FB: C19.2 R12.2 R15.1 U2.1(FB)
1V2_L: L4.1 U2.4(SW)
1V05_EN: R6.2 R9.2 R10.1 U1.5(EN)
1V05_FB: C16.2 R229.2 R230.1 U1.1(FB)
1V05_L: L2.1 U1.4(SW)
NetC1_1: C1.1 R1.1
NetC1_2: C1.2 IC1.1(BST)
NetC5_1: C5.1 IC1.4(SS)
NetC6_1: C6.1 IC1.6(COMP) R4.1
NetC7_1: C7.1 R4.2
NetC20_1: C20.1 R107.1
NetC20_2: C20.2 IC9.1(BST)
NetC63_1: C63.1 IC9.4(SS)
NetC64_1: C64.1 IC9.6(COMP) R110.1
NetC65_1: C65.1 R110.2
NetD1_2: D1.2(Anode) R2.2
NetD15_2: D15.2(Anode) R108.2
NetIC1_5: IC1.5(FB) R3.2 R5.1
NetIC1_8: IC1.8(SW) L1.1 R1.2
NetIC9_5: IC9.5(FB) R109.2 R111.1
NetIC9_8: IC9.8(SW) L3.1 R107.2
NetR8_1: R8.1 U1.6(OUT/PG)
NetR232_1: R232.1 U2.6(OUT/PG)
NetR245_2: R245.2 U3.3(EN)

Not connected (* = marked no-connect by the designer): U3 4(NC)*

### Layout directives
net class HIGH_POWER: VPWR
net class POWER: 1V2_L, 1V05_L, +1V2, +1V05, +3V3, +5V, NetIC1_8, NetIC9_8

### Notes on the sheet
- POWER
- Vout = 0.6 * (R1+R2)/R2
- DWG. NO.
- REV.
- SHT.
- REVISION
- DESCRIPTION
- DATE
- APPROVED
- THIS DOCUMENT AND THE DATA DISCLOSED HEREIN OR HEREWITH IS THE PROPERTY OF ALTIUM LIMITED AND MAY BE FREELY DISTRIBUTED IN WHOLE. NO RIGHTS ARE RESERVED OR EXPRESS OR IMPLIED WARANTEE GIVEN.
- ENG:
- DSN:
- APPROVALS
- PROJECT
- DOCUMENT REVISION:
- DESIGN ITEM:
- CHK:
- BOM:
- REFERENCE DOCUMENTS
- PROJECT REVISION:
- TITLE
- FAB DWG:
- PCB DWG:
- ASSY DWG:
- SCALE:
- SIZE
- C
- CAGE CODE
- FILE NAME
- DWG NO.
- SHEET
- OF
- REV
- (in symbol 0201ZD105MAT2A) C0603
- (in symbol 0402ZA560FAT2A) C0402
- (in symbol 0402ZC122JAT2A) C0402
- (in symbol 0402ZC272JAT2A) C0402
- (in symbol 0402ZC330KAT2A) C0402
- (in symbol 0402ZD102KAT2A) C0402
- (in symbol 0603ZD106KAT2A) C0603
- (in symbol 08055D104KAT2A) C0805
- (in symbol 12065D106KAT4A) C1206
- (in symbol CRCW04022K20FK) R0402
- (in symbol CRCW040210K0FK) R0402
- (in symbol CRCW040210K5FKED) R0402
- (in symbol CRCW040212K0FK) R0402
- (in symbol CRCW040215K0FK) R0402
- (in symbol CRCW040216K0FK) R0402
- (in symbol CRCW040220K0FKEDC) R0402
- (in symbol CRCW040222K1FKEDC) R0402
- (in symbol CRCW040269K8FKEDC) R0402
- (in symbol CRCW0402100RFK) R0402
- (in symbol CRCW0402150RFKEDC) R0402
- (in symbol CRCW0402200KFKEDC) R0402
- (in symbol CRCW04020000Z0) R0402
- (in symbol TP_1mm_SMD) TP

### Library data of the parts
C1 C5 C20 C63 = 08055D104KAT2A: CAP CER 0.1uF 10% 50V X5R 0805; Manufacturer: KYOCERA AVX; Value: 0.1µF; check: ok; Manufacturer Part Number: 08055D104KAT2A; Tolerance: ±10%; Voltage - Rated: 50V; Temperature Coefficient: X5R
C2 C3 C13 C17 C18 C57 C58 C61 = 0603ZD106KAT2A: as C151 on sheet 08_USB_Type-C_DFP_DP_ALT_buttom; Manufacturer Part Number: 0603ZD106KAT2A; Tolerance: ±10%; Voltage - Rated: 10V; Temperature Coefficient: X5R
C4 C62 = 12065D106KAT4A: as C46 on sheet 08_USB_Type-C_DFP_DP_ALT_buttom; Manufacturer Part Number: 12065D106KAT4A; Tolerance: ±10%; Voltage - Rated: 50V; Temperature Coefficient: X5R
C6 = 0402ZD102KAT2A: CAP CER 1nF 10% 10V X5R 0402; Manufacturer: KYOCERA AVX; check: ok; Manufacturer Part Number: 0402ZD102KAT2A; Operating Temperature: -55°C ~ 85°C; Package / Case: 0402 (1005 Metric); Value: 1nF; Voltage - Rated: 10V; Tolerance: ±10%; Temperature Coefficient: X5R
C7 = 0402ZC122JAT2A: CAP CER  1.2nF 10% 10V X7R 0402; Manufacturer: KYOCERA AVX; check: ok; Manufacturer Part Number: 0402ZC122JAT2A; Operating Temperature: -55°C ~ 125°C; Package / Case: 0402 (1005 Metric); Value: 1.2nF; Voltage - Rated: 10V; Tolerance: ±10%; Temperature Coefficient: X7R
C16 C19 = 0402ZC330KAT2A: CAP CER 33pF 10% 10V X7R 0402; Manufacturer: KYOCERA AVX; check: ok; Manufacturer Part Number: 0402ZC330KAT2A; Operating Temperature: -55°C ~ 125°C; Package / Case: 0402 (1005 Metric); Value: 33pF; Voltage - Rated: 10V; Tolerance: ±10%; Temperature Coefficient: X7R
C64 = 0402ZA560FAT2A: CAP CER 56pF 1% 10V NP0 0402; Manufacturer: KYOCERA AVX; check: ok; Manufacturer Part Number: 0402ZA560FAT2A; Operating Temperature: -55°C ~ 125°C; Package / Case: 0402 (1005 Metric); Value: 56pF; Voltage - Rated: 10V; Tolerance: ±1%; Temperature Coefficient: NP0
C65 = 0402ZC272JAT2A: CAP CER  2.7nF 10% 10V X7R 0402; Manufacturer: KYOCERA AVX; check: ok; Manufacturer Part Number: 0402ZC272JAT2A; Operating Temperature: -55°C ~ 125°C; Package / Case: 0402 (1005 Metric); Value: 2.7nF; Voltage - Rated: 10V; Tolerance: ±10%; Temperature Coefficient: X7R
C165 C166 = 0201ZD105MAT2A: CAP CER 1uF 20% 10V X5R 0603; Manufacturer: KYOCERA AVX; Value: 1uF; Tolerance: 20%; Manufacturer Part Number: 0201ZD105MAT2A
D1 D15 = LED_SMD_0603_GREEN: as D21 on sheet 08_USB_Type-C_DFP_DP_ALT_buttom; Supplier 1: Farnell; RoHS: Yes; Category: LEDs; Stock 1: 18400; Pricing 1: 5=0.31000, 10=0.23700, 100=0.10900, 500=0.09900 (EUR); Mount: Surface Mount; Case/Package: 0603; Number of Pins: 2; Case Code (Metric): 1608; Case Code (Imperial): 0603; Min Operating Temperature: -35°C; Max Operating Temperature: 85°C; Packaging: Tape and Reel; Package Quantity: 1; Series: CHipLED; Illumination Color: Green,Yellow; Wavelength: 571nm; Test Current: 20mA; Number of Elements: 1; Power Rating: 75mW; Length: 1.6mm; Width: 0.8mm; Height: 0.8mm; Depth: 0.8mm; Radiation Hardening: No; RoHS Compliant: Yes; Lead Free: Lead Free; ComponentLink1URL: https://datasheet.ciiva.com/8028/vlmo1300-8028023.pdf?src-supplier=Element14; ComponentLink1Description: https://datasheet.ciiva.com/8028/vlmo1300-8028023.pdf?src-supplier=Element14; ComponentLink2URL: https://datasheet.ciiva.com/2114/vlmo1300-2114971.pdf?src-supplier=Digi-Key; ComponentLink2Description: https://datasheet.ciiva.com/2114/vlmo1300-2114971.pdf?src-supplier=Digi-Key; ComponentLink3URL: https://datasheet.ciiva.com/26322/vlmo1300-26322139.pdf?src-supplier=Element14; ComponentLink3Description: https://datasheet.ciiva.com/26322/vlmo1300-26322139.pdf?src-supplier=Element14; ComponentLink4URL: https://datasheet.ciiva.com/2114/vlmo1300-2114972.pdf?src-supplier=Digi-Key; ComponentLink4Description: https://datasheet.ciiva.com/2114/vlmo1300-2114972.pdf?src-supplier=Digi-Key; ComponentLink5URL: https://datasheet.ciiva.com/26322/vlmo1300-26322140.pdf?src-supplier=Element14; ComponentLink5Description: https://datasheet.ciiva.com/26322/vlmo1300-26322140.pdf?src-supplier=Element14; ComponentLink6URL: https://datasheet.ciiva.com/2114/vlmo1300-2114973.pdf?src-supplier=Digi-Key; ComponentLink6Description: https://datasheet.ciiva.com/2114/vlmo1300-2114973.pdf?src-supplier=Digi-Key; ComponentLink7URL: https://datasheet.ciiva.com/9333/vlmo1300-9333390.pdf?src-supplier=Avnet; ComponentLink7Description: https://datasheet.ciiva.com/9333/vlmo1300-9333390.pdf?src-supplier=Avnet; Supplier Part Number 1: 2251461
IC1 IC9 = AP64501SP-13: 3.8V to 40V Input 5A Low IQ Synchronous Buck Converter with Programmable Soft-Start Time 8-Pin SOIC EP T/R; Part Number: IC0031; Manufacturer: Diodes; ID: 31; ManfactPart: AP64501SP-13; RefVal: AP64501SP-13; Supplier 1: Mouser; Manufacturer Part Number: AP64501SP-13; RoHS: Yes; Category: Voltage Regulators - Switching; Stock 1: 13842; Pricing 1: 1=2.41000, 10=2.17000, 50=2.05000, 100=1.74000, 1000=1.19000, 10000=1.08000 (USD); Supplier Part Number 1: 621-AP64501SP-13
J11 = PLS-2: as J9 on sheet 08_USB_Type-C_DFP_DP_ALT_buttom; Supplier 1: Mouser; RoHS: Yes; Category: Connectors; Stock 1: 26660; Pricing 1: 1=0.10000, 10=0.04200, 50=0.04200, 100=0.04000, 1000=0.03500, 10000=0.03000 (USD); Supplier Part Number 1: 523-G800W305018EU; Supplier 2: Mouser; Stock 2: 25697; Pricing 2: 1=0.10000, 10=0.03000, 50=0.03000, 100=0.02900, 1000=0.02600, 10000=0.02100 (USD); Supplier Part Number 2: 523-G800W306018EU
L1 L3 = SRN6045TA-3R3Y: Ind Power Semi-Shielded Wirewound 3.3uH ±30% 1MHz 15 Q-Factor Ferrite 5A T/R; Part Number: IN0005; Manufacturer: Bourns; ID: 5; Saturation Current: 7.8A; DC Resistance (DCR): 21mR; Self Resonant Frequency: 45MHz; RefVal: 3.3µH 5A; ManfactPart: SRN6045TA-3R3Y; Supplier 1: Digi-Key; Manufacturer Part Number: SRN6045TA-3R3Y; RoHS: Yes; Category: Fixed Inductors; Stock 1: 5211; Pricing 1: 1=0.64000, 10=0.55900, 25=0.51920, 50=0.43920, 100=0.39930, 250=0.37532, 500=0.33538 (USD); Mount: Surface Mount; Case/Package: Nonstandard; Core Material: Ferrite; Min Operating Temperature: -55°C; Max Operating Temperature: 125°C; Packaging: Cut Tape; Inductance Tolerance: 30%; Series: SRN6045TA; Tolerance: 30%; Shielding: Shielded; Test Frequency: 1MHz; Ratings: AEC-Q200; Reach SVHC Compliant: Yes; RoHS Compliant: Yes; ComponentLink1URL: http://www.farnell.com/datasheets/2647414.pdf?src-supplier=Farnell; ComponentLink1Description: http://www.farnell.com/datasheets/2647414.pdf?src-supplier=Farnell; ComponentLink2URL: http://www.farnell.com/datasheets/2113223.pdf?src-supplier=Element14; ComponentLink2Description: http://www.farnell.com/datasheets/2113223.pdf?src-supplier=Element14; ComponentLink3URL: https://www.bourns.com/docs/Product-Datasheets/SRN6045TA.pdf?src-supplier=Digi-Key; ComponentLink3Description: https://www.bourns.com/docs/Product-Datasheets/SRN6045TA.pdf?src-supplier=Digi-Key; ComponentLink4URL: http://www.farnell.com/datasheets/2647414.pdf?src-supplier=Newark; ComponentLink4Description: http://www.farnell.com/datasheets/2647414.pdf?src-supplier=Newark; Supplier Part Number 1: SRN6045TA-3R3YCT-ND
L2 L4 = NRH2410T1R0NN4: Inductor Power Shielded Wirewound 1uH 30% 100KHz Ferrite 1.41A 0.084Ohm DCR T/R; Manufacturer: Taiyo Yuden; Saturation Current: 1.8A; DC Resistance (DCR): 84mR; Self Resonant Frequency: 106MHz; Height: 1mm; Series: NRH; Case/Package: 2410; Test Frequency: 100kHz; Halogen Free: Halogen Free; Number of Pins: 2; Termination: SMD/SMT; Tolerance: 30%; Inductance: 1uH; Package Quantity: 1; Radiation Hardening: No; Width: 0.094inch; Min Operating Temperature: -25°C; Max DC Current: 1.8A; Shielding: Shielded; Mount: Surface Mount; Max Operating Temperature: 120°C; RoHS Compliant: Yes; Core Material: Ferrite; Depth: 2.5mm; Packaging: Tape and Reel; Length: 2.4mm; Supplier 1: Digi-Key; Manufacturer Part Number: NRH2410T1R0NN4; RoHS: Yes; Category: Fixed Inductors; Stock 1: 1576; Pricing 1: 1=0.21000, 10=0.18900, 25=0.16760, 50=0.14260, 100=0.12570, 250=0.11528, 500=0.10478, 1000=0.08802 (USD); Mounting Technology: Surface Mount; Pins: 2; ComponentLink1URL: https://datasheet.ciiva.com/8502/nrh2410t1r0nn4-ss-8502790.pdf?src-supplier=Avnet; ComponentLink1Description: https://datasheet.ciiva.com/8502/nrh2410t1r0nn4-ss-8502790.pdf?src-supplier=Avnet; ComponentLink2URL: https://datasheet.ciiva.com/1065/nrh2410t1r0nn4-ss-1065600.pdf?src-supplier=Digi-Key; ComponentLink2Description: https://datasheet.ciiva.com/1065/nrh2410t1r0nn4-ss-1065600.pdf?src-supplier=Digi-Key; ComponentLink3URL: https://datasheet.ciiva.com/25607/0900766b810b3cd2-25607923.pdf?src-supplier=RSComponents; ComponentLink3Description: https://datasheet.ciiva.com/25607/0900766b810b3cd2-25607923.pdf?src-supplier=RSComponents; ComponentLink4URL: https://datasheet.ciiva.com/23806/1749893-23806709.pdf?src-supplier=Newark; ComponentLink4Description: https://datasheet.ciiva.com/23806/1749893-23806709.pdf?src-supplier=Newark; Supplier Part Number 1: 587-2385-1-ND
R1 R107 = CRCW0402100RFK: RES SMD 100 ohm 1% 1/16W R0402; Manufacturer: Vishay; check: ok; Manufacturer Part Number: CRCW0402100RFK; Value: 100; Power (Watts): 1/16W; Package / Case: 0402; Tolerance: ±1%
R2 R108 = CRCW0402150RFKEDC: RES SMD 150 ohm 1% 1/16W R0402; Manufacturer: Vishay Dale; check: ok; Manufacturer Part Number: CRCW0402150RFKEDC; Value: 150; Power (Watts): 1/16W; Package / Case: 0402; Tolerance: ±1%
R3 = CRCW040212K0FK: RES SMD 12K ohm 1% 1/16W R0402; Manufacturer: Vishay; check: ok; Manufacturer Part Number: CRCW040212K0FK; Value: 12K; Power (Watts): 1/16W; Package / Case: 0402; Tolerance: ±1%
R4 = CRCW040220K0FKEDC: RES SMD 20K ohm 1% 1/16W R0402; Manufacturer: Vishay Dale; check: ok; Manufacturer Part Number: CRCW040220K0FKEDC; Value: 20K; Power (Watts): 1/16W; Package / Case: 0402; Tolerance: ±1%
R5 = CRCW04022K20FK: as R175 on sheet 08_USB_Type-C_DFP_DP_ALT_buttom; Manufacturer Part Number: CRCW04022K20FK; Value: 2.2K; Power (Watts): 1/16W; Package / Case: 0402; Tolerance: ±1%
R6 R8 R231 R232 = CRCW04020000Z0: RES SMD 0 ohm 1/16W R0402; Manufacturer: Vishay Dale; check: ok; Manufacturer Part Number: CRCW04020000Z0; Value: 0; Power (Watts): 1/16W; Package / Case: 0402
R9 R10 R13 R14 = CRCW040215K0FK: RES SMD 15K ohm 1% 1/16W R0402; Manufacturer: Vishay Dale; Manufacturer Part Number: CRCW040215K0FK; Value: 15K; Power (Watts): 1/16W; Package / Case: 0402; Tolerance: ±1%
R12 R15 = CRCW0402200KFKEDC: RES SMD 200K ohm 1% 1/16W R0402; Manufacturer: Vishay; check: ok; Manufacturer Part Number: CRCW0402200KFKEDC; Value: 200K; Power (Watts): 1/16W; Package / Case: 0402; Tolerance: ±1%
R109 = CRCW040269K8FKEDC: RES SMD 69.8K ohm 1% 1/16W R0402; Manufacturer: Vishay Dale; check: ok; Manufacturer Part Number: CRCW040269K8FKEDC; Value: 69.8K; Power (Watts): 1/16W; Package / Case: 0402; Tolerance: ±1%
R110 = CRCW040210K5FKED: RES SMD 10.5K ohm 1% 1/16W R0402; Manufacturer: Vishay; check: ok; Manufacturer Part Number: CRCW040210K5FKED; Value: 10.5K; Power (Watts): 1/16W; Package / Case: 0402; Tolerance: ±1%
R111 = CRCW040222K1FKEDC: RES SMD 22.1K ohm 1% 1/16W R0402; Manufacturer: Vishay Dale; check: ok; Manufacturer Part Number: CRCW040222K1FKEDC; Value: 22.1K; Power (Watts): 1/16W; Package / Case: 0402; Tolerance: ±1%
R229 = CRCW040212K0FK: RES SMD 12K ohm 1% 1/16W R0402; Manufacturer: Vishay Dale; Manufacturer Part Number: CRCW040212K0FK; Value: 12K; Power (Watts): 1/16W; Package / Case: 0805 (2012 Metric); Tolerance: ±1%
R230 = CRCW040216K0FK: RES SMD 16K ohm 1% 1/16W R0402; Manufacturer: Vishay Dale; Manufacturer Part Number: CRCW040216K0FK; Value: 16K; Power (Watts): 1/16W; Package / Case: 0402; Tolerance: ±1%
R245 = CRCW040210K0FK: as R172 on sheet 08_USB_Type-C_DFP_DP_ALT_buttom; Manufacturer Part Number: CRCW040210K0FK; Value: 10K; Power (Watts): 1/16W; Package / Case: 0402; Tolerance: ±1%
TP1-TP4 = TP_1mm: Testpoint 1mm; Manufacturer Part Number: General Test Point
TP5-TP9 = TP_1mm_SMD
U1 U2 = AP61202Z6-7: Switching Voltage Regulators DCDC Conv LV Buck SOT563 TR 3K; Manufacturer: Diodes; Supplier 1: Digi-Key; Manufacturer Part Number: AP61202Z6-7; RoHS: No; Stock 1: 2775; Pricing 1: 1=0.45000, 10=0.38600, 25=0.36000, 100=0.28790, 250=0.26732, 500=0.22620, 1000=0.17479 (USD); Supplier Part Number 1: 31-AP61202Z6-7CT-ND
U3 = TPS7A2018PDBVR: IC REG LINEAR 1.8V 300MA SOT23-5; RoHS Compliant: Yes